# Altium project BeagleBone-AI.PrjPcb (part 4 of 5)

## Sheet 18 ADC_TF_Debug.SchDoc
size 420 x 297 mm
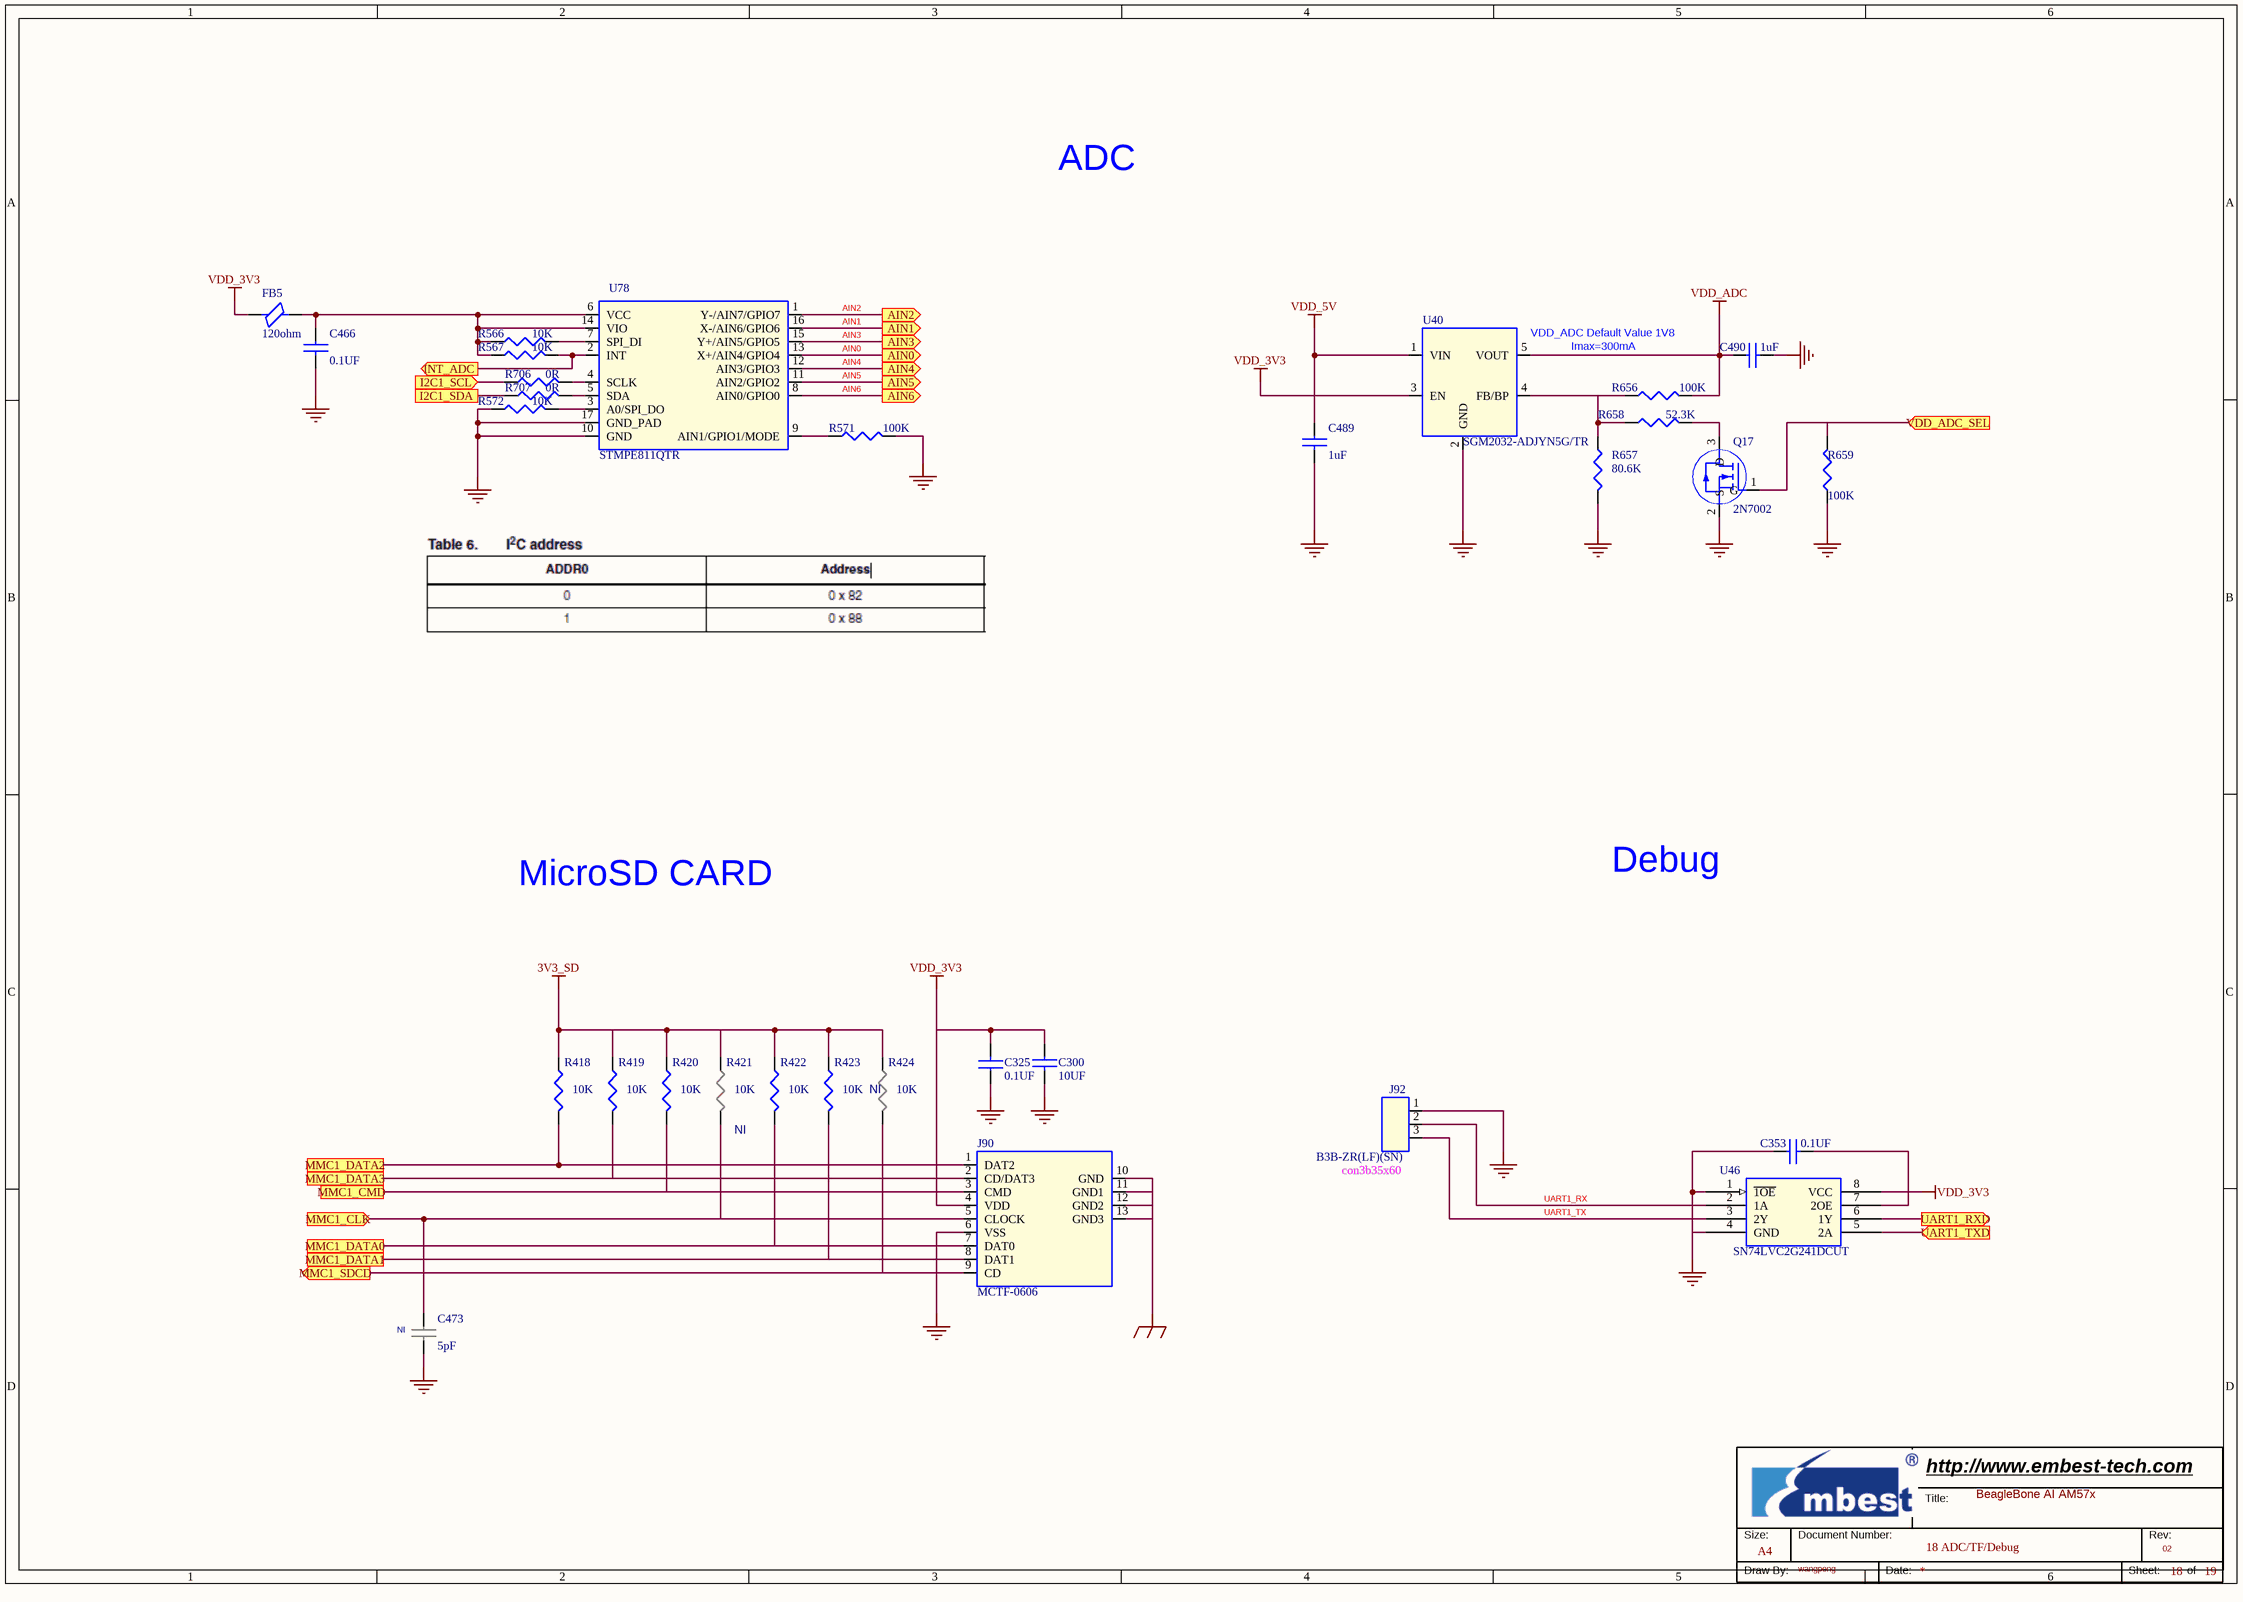
[diagram p19: 18 ADC_TF_Debug.SchDoc]

### Parts
(Parts that share a designator on the sheet are numbered #1, #2 ... from top to bottom, then left to right.)
*#16  Page Count: 19  Page Number: 18  Page Size: A4  Title: BeagleBone AI AM57x  RevCode: 02  Doc: 18 ADC/TF/Debug  Drawing: wangpeng  (hidden comment: Embest Title)  (graphical)
C300  10UF  [C0603]
C325  0.1UF  [C0402]
C353  0.1UF  [C0402]
C466  0.1UF  [C0402]
C473  5pF  ASSY: NI  [C0402]
C489  1uF  [C0402]
C490  1uF  [C0402]
FB5  120ohm  [L0402]
J90  MCTF-0606  [SD_HSF-COMPLIANT_MCTF-0606]
J92  B3B-ZR(LF)(SN)  [con3b35x60]
Q17  2N7002  [SOT23_123]
R418  10K  [R0402]
R419  10K  [R0402]
R420  10K  [R0402]
R421  10K  ASSY: NI  [R0402]
R422  10K  [R0402]
R423  10K  [R0402]
R424  10K  ASSY: NI  [R0402]
R566  10K  [R0402]
R567  10K  [R0402]
R571  100K  [R0402]
R572  10K  [R0402]
R656  100K  [R0402]
R657  80.6K  [R0402]
R658  52.3K  [R0402]
R659  100K  [R0402]
R706  0R  [R0402]
R707  0R  [R0402]
U40  SGM2032-ADJYN5G/TR  [SOT23_5]
U46  SN74LVC2G241DCUT  [vssop8cr]
U78  STMPE811QTR  [QFN50P300X300X100-17N]

### Ports
AIN0 (out), AIN1 (out), AIN2 (out), AIN3 (out), AIN4 (out), AIN5 (out), AIN6 (out), I2C1_SCL (in), I2C1_SDA, INT_ADC (out), MMC1_CLK (in), MMC1_CMD, MMC1_DATA0, MMC1_DATA1, MMC1_DATA2, MMC1_DATA3, MMC1_SDCD (out), UART1_RXD (out), UART1_TXD (in), VDD_ADC_SEL (in)

### Nets
3V3_SD: R418.1 R419.1 R420.1 R421.1 R422.1 R423.1 R424.1
GND: C300.2 C325.1 C353.1 C466.2 C473.2 C489.2 C490.2 J90.6(VSS) J92.1 Q17.2(S) R571.2 R572.1 R657.2 R659.1 U40.2(GND) U46.1(~{1OE}) U46.4(GND) U78.10(GND) U78.17(GND_PAD)  [project net DDR1_RST]
GND_EARTH: J90.10(GND) J90.11(GND1) J90.12(GND2) J90.13(GND3)
VDD_3V3: C300.1 C325.2 FB5.1 J90.4(VDD) U40.3(EN) U46.8(VCC)
VDD_5V: C489.1 U40.1(VIN)
VDD_ADC: C490.1 R656.2 U40.5(VOUT)
AIN0: U78.13(X+/AIN4/GPIO4) ; port AIN0
AIN1: U78.16(X-/AIN6/GPIO6) ; port AIN1
AIN2: U78.1(Y-/AIN7/GPIO7) ; port AIN2
AIN3: U78.15(Y+/AIN5/GPIO5) ; port AIN3
AIN4: U78.12(AIN3/GPIO3) ; port AIN4
AIN5: U78.11(AIN2/GPIO2) ; port AIN5
AIN6: U78.8(AIN0/GPIO0) ; port AIN6
I2C1_SCL: R706.1 ; port I2C1_SCL
I2C1_SDA: R707.1 ; port I2C1_SDA
UART1_RX: J92.2 U46.2(1A)
UART1_TX: J92.3 U46.3(2Y)
NetC353_2: C353.2 U46.7(2OE)
NetC466_1: C466.1 FB5.2 R566.1 R567.1 U78.6(VCC) U78.14(VIO)
NetC473_1: C473.1 J90.5(CLOCK) R421.2 ; port MMC1_CLK
NetJ90_1: J90.1(DAT2) R418.2 ; port MMC1_DATA2
NetJ90_2: J90.2(CD/DAT3) R419.2 ; port MMC1_DATA3
NetJ90_3: J90.3(CMD) R420.2 ; port MMC1_CMD
NetJ90_7: J90.7(DAT0) R422.2 ; port MMC1_DATA0
NetJ90_8: J90.8(DAT1) R423.2 ; port MMC1_DATA1
NetJ90_9: J90.9(CD) R424.2 ; port MMC1_SDCD
NetQ17_1: Q17.1(G) R659.2 ; port VDD_ADC_SEL
NetQ17_3: Q17.3(D) R658.2
NetR173_2: U46.6(1Y) ; port UART1_RXD
NetR566_2: R566.2 U78.7(SPI_DI)
NetR567_2: R567.2 U78.2(INT) ; port INT_ADC
NetR571_1: R571.1 U78.9(AIN1/GPIO1/MODE)
NetR572_2: R572.2 U78.3(A0/SPI_DO)
NetR656_1: R656.1 R657.1 R658.1 U40.4(FB/BP)
NetR706_2: R706.2 U78.4(SCLK)
NetR707_2: R707.2 U78.5(SDA)
NetU4_C26: U46.5(2A) ; port UART1_TXD

### Notes on the sheet
- ADC
- (near U40) VDD_ADC Default Value 1V8
- Imax=300mA
- MicroSD CARD
- Debug
- (in symbol Embest Title) Title:; Size:; Document Number:; Rev:; Draw By:; Date:; Sheet:; of

### Library data of the parts
C300 = C: CAP,10UF,+/-10%,X5R,10V,SMD0603; Manufacturer Part Number: GRM188R61A106KE69D; Manufacturer: Murata; Embest PN: 1004001100129; Datasheet: Y:\ÐÂK3ÏµÍ³ÎïÁÏdatasheet\[1003_1004]capacitor-resistor µçÈÝ¡¢µç×è\1004001100129T2 C1608X5R1A106M.pdf; Part Type: Ceramic Capacitor
C325 C353 = C: CAP,100NF,+/-10%,X7R,16V,SMD0402; Manufacturer: Murata; Manufacturer Part Number: GRM155R71C104KA88D; Embest PN: 1004001100047; Part Type: Ceramic Capacitor; Datasheet: Y:\ÐÂK3ÏµÍ³ÎïÁÏdatasheet\[1003_1004]capacitor-resistor µçÈÝ¡¢µç×è\1004001100047-GRM155R71C104KA88D.pdf
C466 = C: CAP,100NF,+/-10%,X7R,16V,SMD0402; Manufacturer Part Number: GRM155R71C104KA88D; Manufacturer: Murata; Embest PN: 1004001100047; Datasheet: Y:\ÐÂK3ÏµÍ³ÎïÁÏdatasheet\[1003_1004]capacitor-resistor µçÈÝ¡¢µç×è\1004001100047-GRM155R71C104KA88D.pdf; Part Type: Ceramic Capacitor
C473 = C: CAP,5PF,+/-0.25PF,C0G,50V,SMD0402; Manufacturer Part Number: GRM1555C1H5R0CA01D; Manufacturer: Murata; Embest PN: 1004001100004; Part Type: Ceramic Capacitor
C489 = C: CAP,1UF,+/-10%,X5R,10V,SMD0402; Manufacturer: Murata; Manufacturer Part Number: GRM155R61A105KE15D; Embest PN: 1004001100057; Part Type: Ceramic Capacitor
C490 = C: CAP,1UF,+/-10%,X5R,10V,SMD0402; Manufacturer Part Number: GRM155R61A105KE15D; Manufacturer: Murata; Embest PN: 1004001100057; Part Type: Ceramic Capacitor
FB5 = FB: Ferrite Bead,120ohm@100MHz,+/-25%,1300mA,90mohm,SMD0402; Manufacturer: Murata; Manufacturer Part Number: BLM15PD121SN1D; Embest PN: 1005005100058; Part Type: Ferrite Bead
J90 = MCTF-0606: Card Connector MCTF-0606 Connector,MicroSD Card CONN with detect switch,Gold Flash 1u,Black,SMD MTCONN Hamster AM572x; Manufacturer: HSF; Embest PN: 1009017100086; PCB Footprint: SD_HSF-COMPLIANT_MCTF-0606; Part Type: Card Connector; Manufacturer Part Number: MCTF-0606; Status: Hamster AM572x; Datasheet: Y:\ÐÂK3ÏµÍ³ÎïÁÏdatasheet\[1009]connectors Á¬½ÓÆ÷\1009017100086 MCTF-0606.pdf
J92 = SIP3: Connector, Wire-To-Board Top Entry, ZH Series, Through Hole, Header, 3PIN, 1.5 mm, Tin Plated Contacts; Manufacturer: JST; Embest PN: 1009014200068; PCB Footprint: con3b35x60; Part Type: Terminal Block; Manufacturer Part Number: B3B-ZR(LF)(SN); Status: TBD; Datasheet: Y:\ÐÂK3ÏµÍ³ÎïÁÏdatasheet\[1009]connectors Á¬½ÓÆ÷\1009014200068 B3B-ZR(LF)(SN).pdf
Q17 = NMOS: Mosfet,N-Channel,2N7002,60V,115mA,SOT-23,SMD; Manufacturer: FAIRCHILD; Embest PN: 1006015100003; Datasheet: Y:\ÐÂK3ÏµÍ³ÎïÁÏdatasheet\[1006014~16]mosfet ³¡Ð§Ó¦¹Ü\1006015100003 2n7002 Fairchild.pdf; Manufacturer Part Number: 2N7002; Part Type: MOSFET
R418-R424 = R: RES,10K,+/-1%,1/16W,SMD0402; Manufacturer: YAGEO; Manufacturer Part Number: RC0402FR-0710KL; Embest PN: 1003001100071; Part Type: Thick film Resistor
R566 R572 = R: RES,10K,+/-5%,1/16W,SMD0402; Manufacturer Part Number: RC0402JR-0710KL; Manufacturer: YAGEO; Embest PN: 1003001100072; Part Type: Thick film Resistor
R567 = R: RES,10K,+/-5%,1/16W,SMD0402; Manufacturer: YAGEO; Manufacturer Part Number: RC0402JR-0710KL; Embest PN: 1003001100072; Part Type: Thick film Resistor
R571 = R: RES,100K,+/-5%,1/16W,SMD0402; Manufacturer Part Number: RC0402JR-07100KL; Manufacturer: YAGEO; Embest PN: 1003001100119; Part Type: Thick film Resistor
R656 = R: RES,100K,+/-1%,1/16W,SMD0402; Manufacturer: YAGEO; Manufacturer Part Number: RC0402FR-07100KL; Embest PN: 1003001100120; Part Type: Thick film Resistor
R657 = R: RES,80K6,+/-1%,1/16W,SMD0402; Manufacturer Part Number: RC0402FR-0780K6L; Manufacturer: YAGEO; Embest PN: 1003001100565; Part Type: Thick film Resistor
R658 = R: RES,52K3,+/-1%,1/16W,SMD0402; Manufacturer: YAGEO; Manufacturer Part Number: RC0402FR-0752K3L; Embest PN: 1003001100107; Part Type: Thick film Resistor
R659 = R: RES,100K,+/-1%,1/16W,SMD0402; Manufacturer Part Number: RC0402FR-07100KL; Manufacturer: YAGEO; Embest PN: 1003001100120; Part Type: Thick film Resistor
R706 R707 = R: RES,0R,+/-5%,1/16W,SMD0402; Manufacturer Part Number: RC0402JR-070RL; Manufacturer: YAGEO; Embest PN: 1003001100001; Part Type: Thick film Resistor
U40 = SGM2032: IC,300mA Low Power Low Dropout RF Linear Regulators,SGM2032-ADJYN5G/TR,SOT23-5,SMD; Manufacturer: KINGSTON; Embest PN: 1002006100080; Datasheet: Y:\ÐÂK3ÏµÍ³ÎïÁÏdatasheet\[1002]IC ¼¯³ÉµçÂ·\1002006100080_SGM2032_SG-Micro.pdf; Manufacturer Part Number: SGM2032-ADJYN5G/TR; Part Type: LDO
U46 = SN74LVC2G241DCUT: IC,Dual Buffer and Line Driver,SN74LVC2G241DCUT,US8,SMD; Manufacturer: TI; PN: 1002008100076; Status: AVL; Manufacturer Part Number: SN74LVC2G241DCUT; Part Type: Logic; Embest PN: 1002008100076
U78 = STMPE811QTR: 12 bit ADC,S-Touch? advanced resistive touchscreen controller with 8-bit GPIO expander; Manufacturer: STMicroelectronics; Embest PN: 1002020100004; PCB Footprint: QFN50P300X300X100-17N; Part Type: IC; Manufacturer Part Number: STMPE811QTR; Status: Hamster AM572x; Datasheet: Y:\ÐÂK3ÏµÍ³ÎïÁÏdatasheet\[1002]IC ¼¯³ÉµçÂ·\1002020100004_STMPE811_ST.pdf
*#16 = Embest Title: Page Create Date: May 29, 2006; WebSite: http://www.embest-tech.com; Company: Embest; Page Modify Date: *

## Sheet 19 HDMI.SchDoc
size 420 x 297 mm
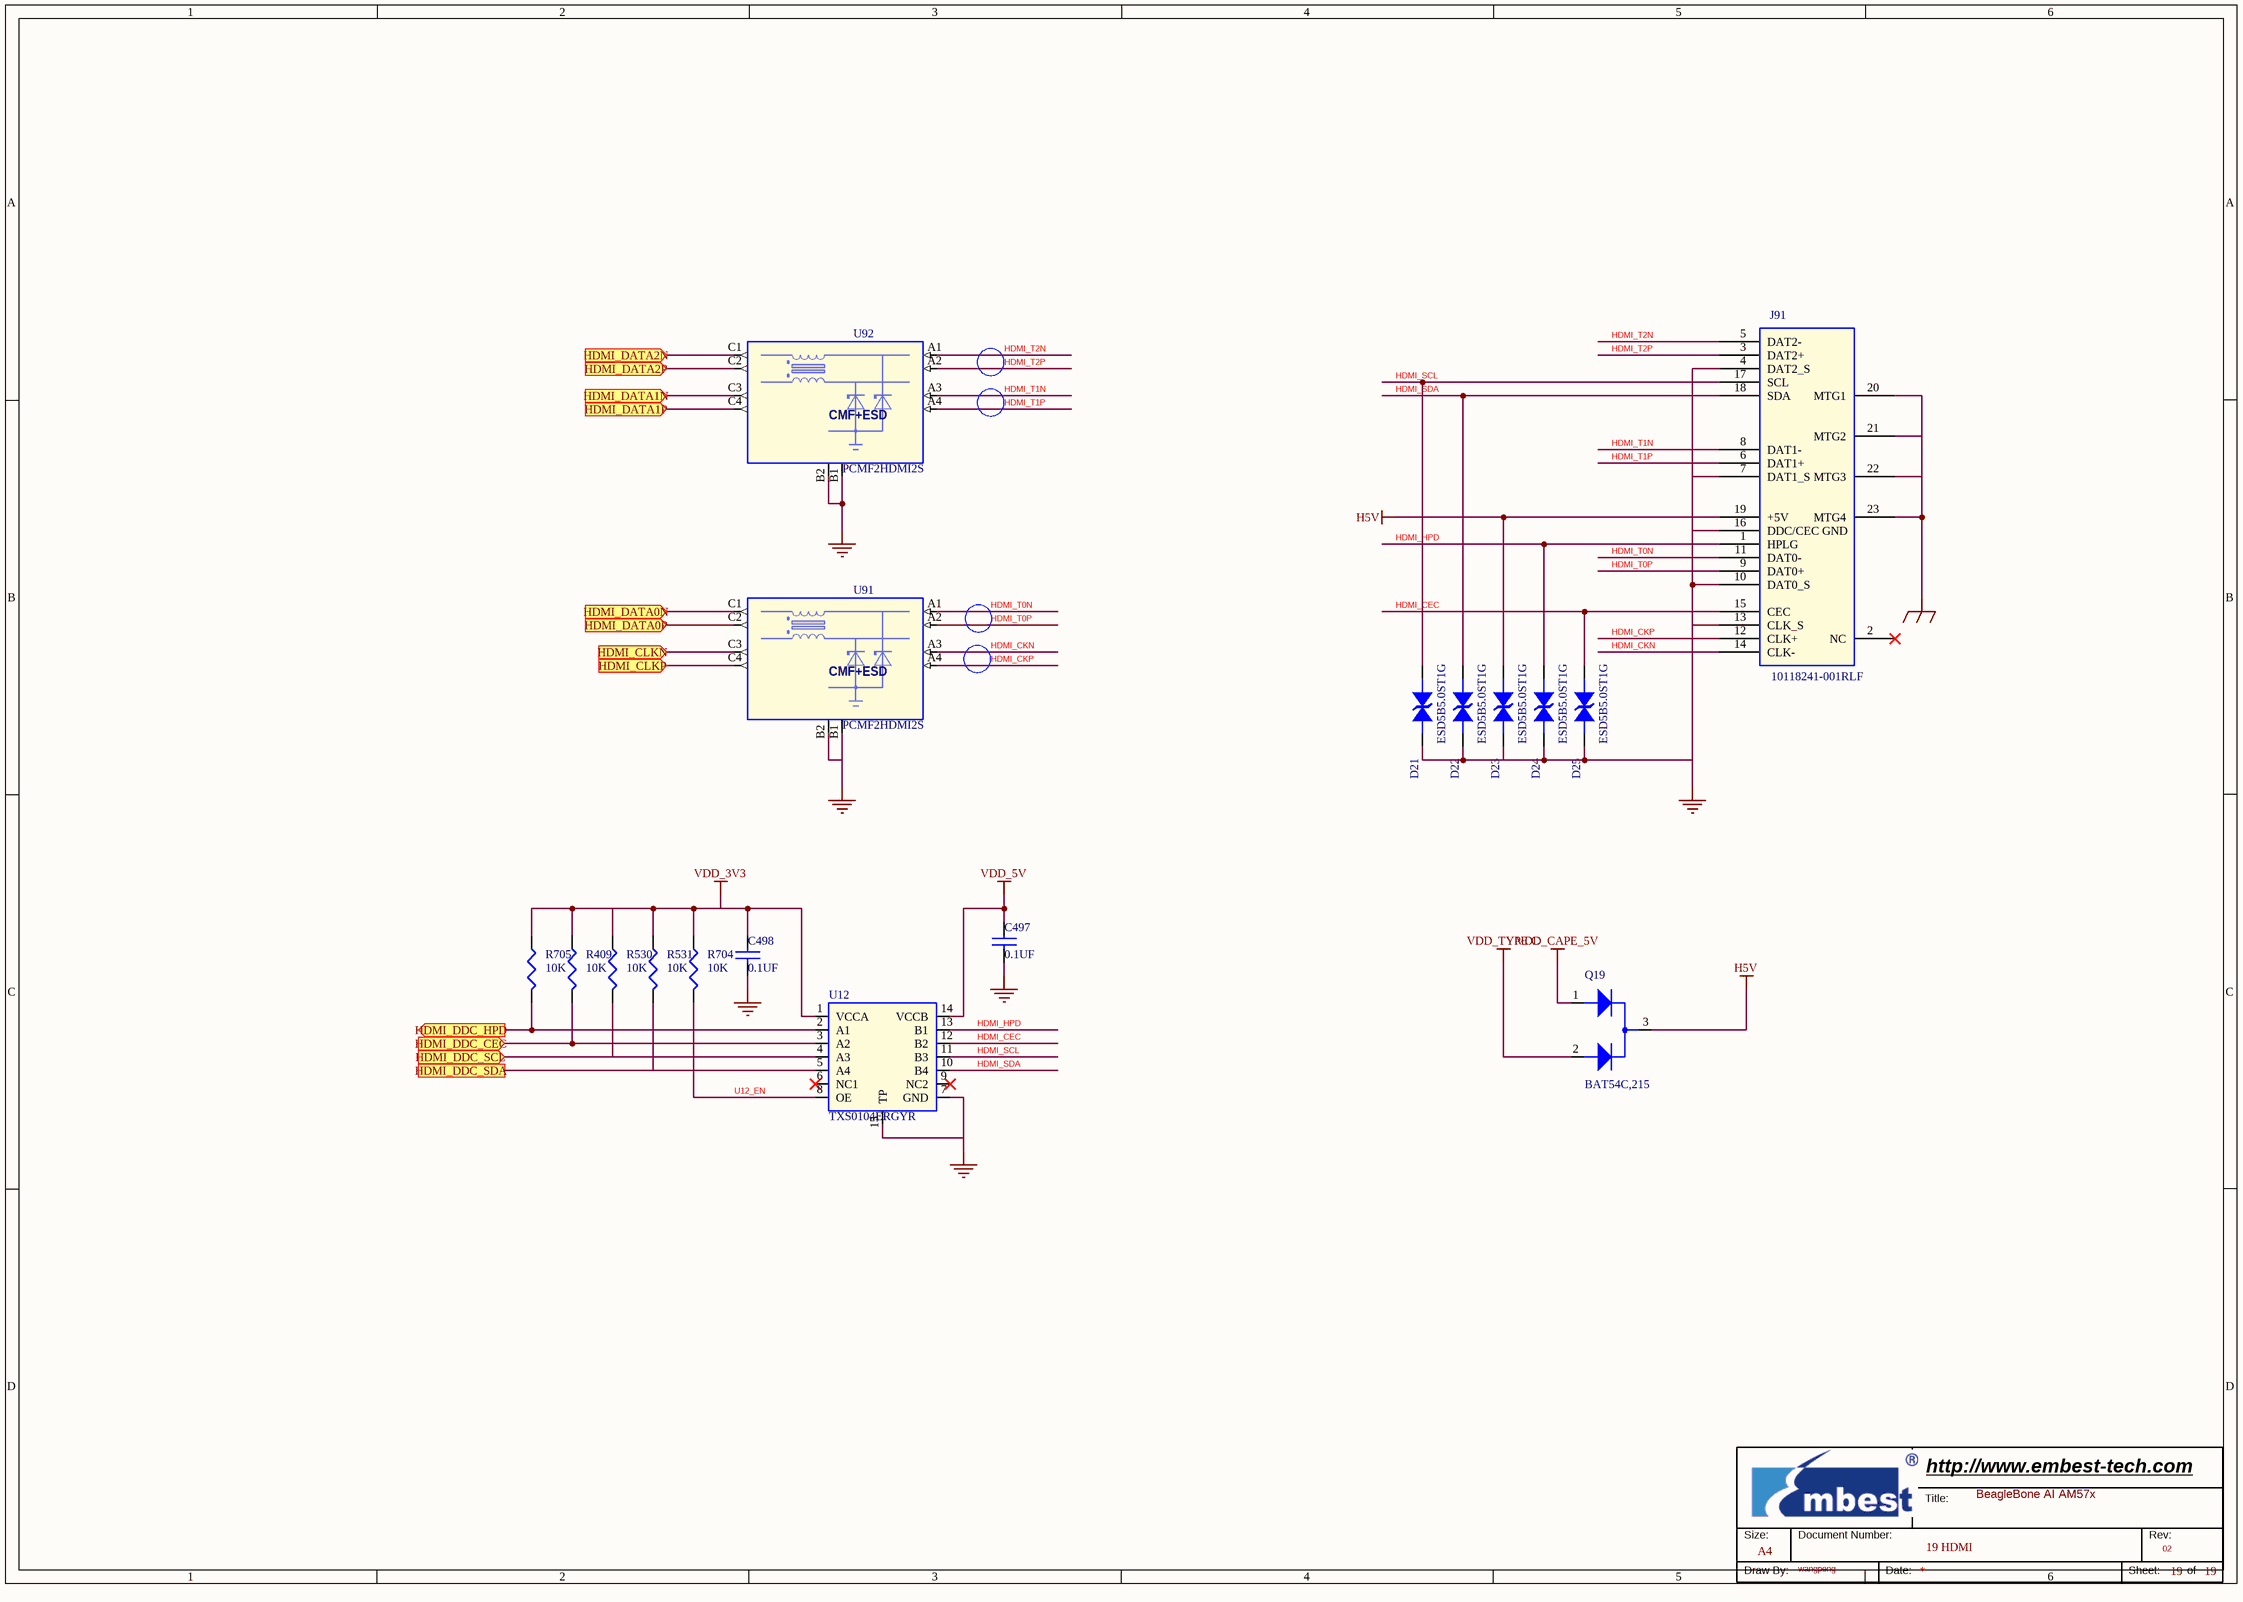
[diagram p20: 19 HDMI.SchDoc]

### Parts
(Parts that share a designator on the sheet are numbered #1, #2 ... from top to bottom, then left to right.)
*#17  Page Count: 19  Page Size: A4  Title: BeagleBone AI AM57x  RevCode: 02  Doc: 19 HDMI  Drawing: wangpeng  (hidden comment: Embest Title)  (graphical)
C497  0.1UF  [C0402]
C498  0.1UF  [C0402]
D21  ESD5B5.0ST1G  [SODFL1608x70N]
D22  ESD5B5.0ST1G  [SODFL1608x70N]
D23  ESD5B5.0ST1G  [SODFL1608x70N]
D24  ESD5B5.0ST1G  [SODFL1608x70N]
D25  ESD5B5.0ST1G  [SODFL1608x70N]
J91  10118241-001RLF  [hdmis19_4p4]
Q19  BAT54C,215  [sot23_123]
R409  10K  [R0402]
R530  10K  [R0402]
R531  10K  [R0402]
R704  10K  [R0402]
R705  10K  [R0402]
U12  TXS0104ERGYR  [qfn50p350x350x100-15n]
U91  PCMF2HDMI2S  [WLCSP10C40p3x4_117x157x60N]
U92  PCMF2HDMI2S  [WLCSP10C40p3x4_117x157x60N]

### Ports
HDMI_CLKN (in), HDMI_CLKP (in), HDMI_DATA0N (in), HDMI_DATA0P (in), HDMI_DATA1N (in), HDMI_DATA1P (in), HDMI_DATA2N (in), HDMI_DATA2P (in), HDMI_DDC_CEC (in), HDMI_DDC_HPD (out), HDMI_DDC_SCL (in), HDMI_DDC_SDA

### Nets
GND: C497.2 C498.2 D21.1 D22.1 D23.1 D24.1 D25.1 J91.4(DAT2_S) J91.7(DAT1_S) J91.10(DAT0_S) J91.13(CLK_S) J91.16(DDC/CEC_GND) U12.7(GND) U12.15(TP) U91.B1(GND_CH1) U91.B2(GND_CH2) U92.B1(GND_CH1) U92.B2(GND_CH2)  [project net DDR1_RST]
GND_EARTH: J91.20(MTG1) J91.21(MTG2) J91.22(MTG3) J91.23(MTG4)
H5V: D23.2 J91.19(+5V) Q19.3
VDD_3V3: C498.1 R409.1 R530.1 R531.1 R704.1 R705.1 U12.1(VCCA)
VDD_5V: C497.1 U12.14(VCCB)
VDD_CAPE_5V: Q19.1
VDD_TYPE C: Q19.2
HDMI_CEC: D25.2 J91.15(CEC) U12.12(B2)
HDMI_CKN: J91.14(CLK-) U91.A3(CH2_IN+)
HDMI_CKP: J91.12(CLK+) U91.A4(CH2_IN-)
HDMI_HPD: D24.2 J91.1(HPLG) U12.13(B1)
HDMI_SCL: D21.2 J91.17(SCL) U12.11(B3)
HDMI_SDA: D22.2 J91.18(SDA) U12.10(B4)
HDMI_T0N: J91.11(DAT0-) U91.A1(CH1_IN+)
HDMI_T0P: J91.9(DAT0+) U91.A2(CH1_IN-)
HDMI_T1N: J91.8(DAT1-) U92.A3(CH2_IN+)
HDMI_T1P: J91.6(DAT1+) U92.A4(CH2_IN-)
HDMI_T2N: J91.5(DAT2-) U92.A1(CH1_IN+)
HDMI_T2P: J91.3(DAT2+) U92.A2(CH1_IN-)
U12_EN: R704.2 U12.8(OE)
NetR409_2: R409.2 U12.3(A2) ; port HDMI_DDC_CEC
NetR530_2: R530.2 U12.4(A3) ; port HDMI_DDC_SCL
NetR531_2: R531.2 U12.5(A4) ; port HDMI_DDC_SDA
NetR705_2: R705.2 U12.2(A1) ; port HDMI_DDC_HPD
NetU4_AG16: U91.C3(CH2_OUT+) ; port HDMI_CLKN
NetU4_AG17: U91.C1(CH1_OUT+) ; port HDMI_DATA0N
NetU4_AG18: U92.C3(CH2_OUT+) ; port HDMI_DATA1N
NetU4_AG19: U92.C1(CH1_OUT+) ; port HDMI_DATA2N
NetU4_AH16: U91.C4(CH2_OUT-) ; port HDMI_CLKP
NetU4_AH17: U91.C2(CH1_OUT-) ; port HDMI_DATA0P
NetU4_AH18: U92.C4(CH2_OUT-) ; port HDMI_DATA1P
NetU4_AH19: U92.C2(CH1_OUT-) ; port HDMI_DATA2P

Not connected (* = marked no-connect by the designer): J91 2(NC)*; U12 6(NC1)* 9(NC2)*

### Notes on the sheet
- (in symbol Embest Title) Title:; Size:; Document Number:; Rev:; Draw By:; Date:; Sheet:; of
- (in symbol PCMF2HDMI2S) CMF+ESD

### Library data of the parts
C497 C498 = C: as C325 on sheet 18 ADC_TF_Debug; Part Type: Ceramic Capacitor; Datasheet: Y:\ÐÂK3ÏµÍ³ÎïÁÏdatasheet\[1003_1004]capacitor-resistor µçÈÝ¡¢µç×è\1004001100047-GRM155R71C104KA88D.pdf
D21-D25 = Diode TVS Dual: Diode,TVS,ESD5B5.0ST1G,5V,50W,SOD-523,SMD; Manufacturer: ON; Embest PN: 1006005100019; Part Type: Diode; Manufacturer Part Number: ESD5B5.0ST1G; Status: BeagleBone AI; Datasheet: Y:\ÐÂK3ÏµÍ³ÎïÁÏdatasheet\[1006002~013]diodes-transistors ¶þÈý¼«¹Ü\1006005100019_ESD5B5.0ST1G_ON
J91 = hdmis19_4p4: Connector,HDMI Receptacle, Type D, Right Angle,DIP+ SMT leg; Manufacturer: FCI; Embest PN: 1009008100005; Part Type: HDMI Connector; Manufacturer Part Number: 10118241-001RLF; Status: BB-Black(AM437x)
Q19 = Diode dual_cc: Diode,Schottky Barrier(Double) Diodes,BAT54C,215,30V,200mA,SOT-23,SMD; Manufacturer: NXP; Embest PN: 1006003100004; Datasheet: Y:\ÐÂK3ÏµÍ³ÎïÁÏdatasheet\[1006002~013]diodes-transistors ¶þÈý¼«¹Ü\1006003100004 BAT54C 215.pdf; Manufacturer Part Number: BAT54C,215; Part Type: Diode
R409 R704 R705 = R: as R418 on sheet 18 ADC_TF_Debug; Part Type: Thick film Resistor
R530 R531 = R: RES,10K,+/-1%,1/16W,SMD0402; Manufacturer Part Number: RC0402FR-0710KL; Manufacturer: YAGEO; Embest PN: 1003001100071; Part Type: Thick film Resistor
U12 = TXS0104ERGYR: IC,TXS0104E 4-Bit Bidirectional Voltage-Level Translator For Open-Drain and Push-PullApplications 14-QFN,SMD; Manufacturer: TI; Embest PN: 1002008100180; Datasheet: Y:\ÐÂK3ÏµÍ³ÎïÁÏdatasheet\[1002]IC ¼¯³ÉµçÂ·\1002008100180 TXS0104ERGYR.pdf; Status: som-sm9300; Manufacturer Part Number: TXS0104ERGYR; Part Type: Logic
U91 U92 = PCMF2HDMI2S: EMI filter with integrated ElectroStatic Discharge protection two differential channels,PCMF2HDMI2S,SMD; Manufacturer: Nexperia; CLASS: IC; Embest PN: 1013002100030; Status: IMX 8; Manufacturer Part Number: PCMF2HDMI2S; Part Type: Filter
*#17 = Embest Title: Page Number: 19; Page Create Date: May 29, 2006; WebSite: http://www.embest-tech.com; Company: Embest; Page Modify Date: *

## Sheet PMIC REGULATORS.SchDoc
size B
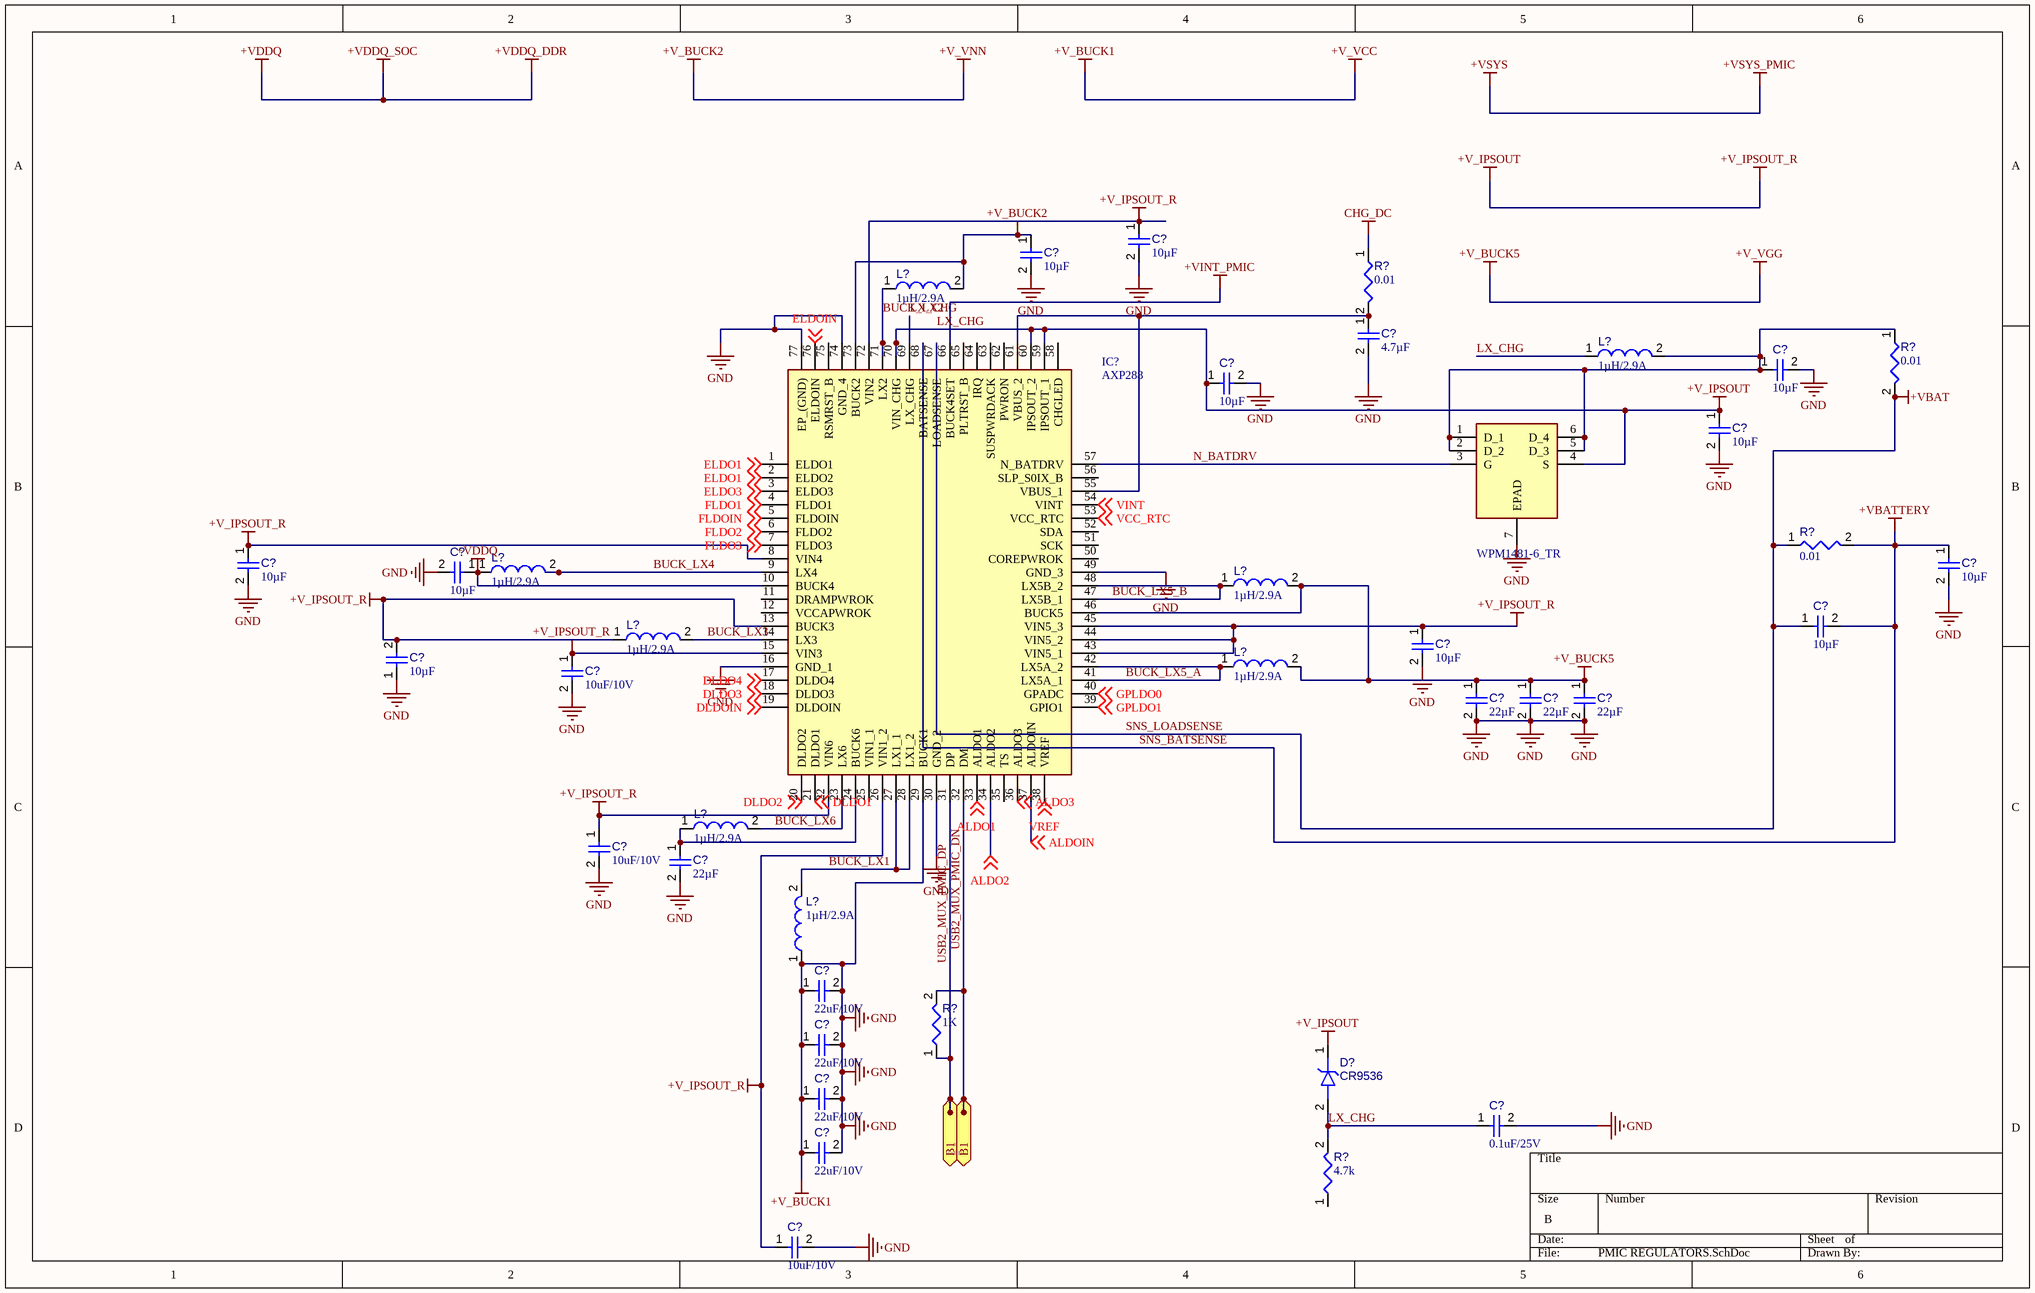
[diagram p21: PMIC REGULATORS.SchDoc]

### Parts
(Parts that share a designator on the sheet are numbered #1, #2 ... from top to bottom, then left to right.)
?  WPM1481-6_TR  [SON65P200X200X80-7N-D]
C?#1  value 10µF  [CAPC0402(1005)60_L]  (hidden comment: Capacitor 10µF +/-40% 6.3V 0402)
C?#2  value 10µF  [CAPC0402(1005)60_L]  (hidden comment: Capacitor 10µF +/-40% 6.3V 0402)
C?#3  value 4.7µF  [CAPC0805(2012)145_L]  (hidden comment: Capacitor 47µF +/-40% 6.3V 0805)
C?#4  value 10µF  [CAPC0402(1005)60_L]  (hidden comment: Capacitor 10µF +/-40% 6.3V 0402)
C?#5  value 10µF  [CAPC0805(2012)145_L]  (hidden comment: Capacitor 10µF +/-20% 25V 0805)
C?#6  value 10µF  [CAPC0402(1005)60_L]  (hidden comment: Capacitor 10µF +/-40% 6.3V 0402)
C?#7  value 10µF  [CAPC0402(1005)60_L]  (hidden comment: Capacitor 10µF +/-40% 6.3V 0402)
C?#8  value 10µF  [CAPC3216X180X50ML20T25]  (hidden comment: Capacitor 10 uF +/- 10% 16 V 1206)
C?#9  value 10µF  [CAPC0402(1005)60_L]  (hidden comment: Capacitor 10µF +/-40% 6.3V 0402)
C?#10  value 10µF  [CAPC0402(1005)60_L]  (hidden comment: Capacitor 10µF +/-40% 6.3V 0402)
C?#11  value 10µF  [CAPC3216X180X50ML20T25]  (hidden comment: Capacitor 10 uF +/- 10% 16 V 1206)
C?#12  value 10uF/10V  [CAPC0402(1005)60_L]  (hidden comment: Capacitor 100nF +/-20% 25V 0402)
C?#13  value 10µF  [CAPC0402(1005)60_L]  (hidden comment: Capacitor 10µF +/-40% 6.3V 0402)
C?#14  value 22µF  [CAPC0402(1005)60_L]  (hidden comment: Capacitor 10µF +/-40% 6.3V 0402)
C?#15  value 22µF  [CAPC0402(1005)60_L]  (hidden comment: Capacitor 10µF +/-40% 6.3V 0402)
C?#16  value 22µF  [CAPC0402(1005)60_L]  (hidden comment: Capacitor 10µF +/-40% 6.3V 0402)
C?#17  value 10uF/10V  [CAPC0402(1005)60_L]  (hidden comment: Capacitor 100nF +/-20% 25V 0402)
C?#18  value 22µF  [CAPC0402(1005)60_L]  (hidden comment: Capacitor 10µF +/-40% 6.3V 0402)
C?#19  value 22uF/10V  [CAPC0402(1005)60_L]  (hidden comment: Capacitor 10µF +/-40% 6.3V 0402)
C?#20  value 22uF/10V  [CAPC0402(1005)60_L]  (hidden comment: Capacitor 10µF +/-40% 6.3V 0402)
C?#21  value 22uF/10V  [CAPC0402(1005)60_L]  (hidden comment: Capacitor 10µF +/-40% 6.3V 0402)
C?#22  value 0.1uF/25V  [CAPC0402(1005)33_L]  (hidden comment: Capacitor 680pF +/-20% 50V 0402)
C?#23  value 22uF/10V  [CAPC0402(1005)60_L]  (hidden comment: Capacitor 10µF +/-40% 6.3V 0402)
C?#24  value 10uF/10V  [CAPC0402(1005)60_L]  (hidden comment: Capacitor 100nF +/-20% 25V 0402)
D?#1  CR9536  [STM-QFN1610]
IC?  AXP288  [QFN40P900X900X90-77N-D]
L?#1  WPN252012H1R0MT: 1µH/2.9A  [WE-LQS 4018]  (hidden comment: 74404042330)
L?#2  WPN252012H1R0MT: 1µH/2.9A  [WE-LQS 4018]  (hidden comment: 74404042330)
L?#3  WPN252012H1R0MT: 1µH/2.9A  [WE-LQS 4018]  (hidden comment: 74404042330)
L?#4  WPN252012H1R0MT: 1µH/2.9A  [WE-LQS 4018]  (hidden comment: 74404042330)
L?#5  WPN252012H1R0MT: 1µH/2.9A  [WE-LQS 4018]  (hidden comment: 74404042330)
L?#6  WPN252012H1R0MT: 1µH/2.9A  [WE-LQS 4018]  (hidden comment: 74404042330)
L?#7  WPN252012H1R0MT: 1µH/2.9A  [WE-LQS 4018]  (hidden comment: 74404042330)
L?#8  WPN252012H1R0MT: 1µH/2.9A  [WE-LQS 4018]  (hidden comment: 74404042330)
R?#1  value 0.01  [RESC0402(1005)_L]  (hidden comment: Resistor 47K5 +/-1 % 0402 63 mW)
R?#2  value 0.01  [RESC0402(1005)_L]  (hidden comment: Resistor 47K5 +/-1 % 0402 63 mW)
R?#3  value 0.01  [RESC0402(1005)_L]  (hidden comment: Resistor 47K5 +/-1 % 0402 63 mW)
R?#4  value 1K  [RESC0402(1005)_L]  (hidden comment: Resistor 47K5 +/-1 % 0402 63 mW)
R?#5  value 4.7k  [RESC1005X40X25ML05T05]  (hidden comment: Resistor 4k7 +/-1% 0402 63 mW)

### Ports
B1 (bidir)

### Nets
+V_BUCK1: ?.7(EPAD) C?#1.2 C?#2.2 C?#3.2 C?#4.2 C?#5.2 C?#6.2 C?#7.2 C?#8.2 C?#9.2 C?#10.2 C?#12.2 C?#13.1 C?#14.2 C?#15.2 C?#16.2 C?#17.2 C?#18.2 C?#19.1 C?#19.2 C?#20.1 C?#20.2 C?#21.1 C?#21.2 C?#22.2 C?#23.1 C?#23.2 C?#24.2 IC?.16(GND_1) IC?.29(BUCK1) IC?.30(GND_2) IC?.49(GND_3) IC?.74(GND_4) IC?.77(EP_(GND)) L?#8.1  [also labelled +V_VCC, GND]  [project net DDR1_RST]
+V_BUCK2: C?#2.1 IC?.73(BUCK2) L?#1.2  [also labelled +V_VNN]
+V_BUCK5: C?#14.1 C?#15.1 C?#16.1 IC?.46(BUCK5) L?#4.2 L?#6.2  [also labelled +V_VGG]
+VDDQ: C?#9.1 IC?.10(BUCK4) L?#3.1  [also labelled +VDDQ_DDR, +VDDQ_SOC]
+VINT_PMIC: IC?.66(BUCK4SET)
CHG_DC: R?#1.1
LX_CHG: ?.4(S) C?#1.1 C?#5.1 C?#6.1 C?#7.1 C?#10.1 C?#12.1 C?#13.2 C?#17.1 C?#22.1 C?#24.1 D?#1.1(A) D?#1.2(A) IC?.8(VIN4) IC?.13(BUCK3) IC?.15(VIN3) IC?.22(VIN6) IC?.26(VIN1_2) IC?.43(VIN5_1) IC?.44(VIN5_2) IC?.45(VIN5_3) IC?.59(IPSOUT_1) IC?.60(IPSOUT_2) IC?.69(LX_CHG) IC?.70(VIN_CHG) IC?.72(VIN2) L?#2.1 L?#5.1 R?#5.2  [also labelled +V_IPSOUT, +V_IPSOUT_R]
SNS_BATSENSE: C?#8.1 C?#11.2 IC?.68(BATSENSE) R?#3.2  [also labelled +VBATTERY]
SNS_LOADSENSE: C?#11.1 IC?.67(LOADSENSE) R?#2.2 R?#3.1  [also labelled +VBAT]
ALDO1: IC?.33(ALDO1) ; off-sheet ALDO1
ALDO2: IC?.34(ALDO2) ; off-sheet ALDO2
ALDO3: IC?.36(ALDO3) ; off-sheet ALDO3
ALDOIN: IC?.37(ALDOIN) ; off-sheet ALDOIN
BUCK_LX1: IC?.27(LX1_1) IC?.28(LX1_2) L?#8.2
BUCK_LX2: IC?.71(LX2) L?#1.1
BUCK_LX3: IC?.14(LX3) L?#5.2
BUCK_LX4: IC?.9(LX4) L?#3.2
BUCK_LX5_A: IC?.41(LX5A_1) IC?.42(LX5A_2) L?#6.1
BUCK_LX5_B: IC?.47(LX5B_1) IC?.48(LX5B_2) L?#4.1
BUCK_LX6: IC?.23(LX6) L?#7.2
DLDO1: IC?.21(DLDO1) ; off-sheet DLDO1
DLDO2: IC?.20(DLDO2) ; off-sheet DLDO2
DLDO3: IC?.18(DLDO3) ; off-sheet DLDO3
DLDO4: IC?.17(DLDO4) ; off-sheet DLDO4
DLDOIN: IC?.19(DLDOIN) ; off-sheet DLDOIN
ELDO1: IC?.1(ELDO1) IC?.2(ELDO2) ; off-sheet ELDO1
ELDO3: IC?.3(ELDO3) ; off-sheet ELDO3
ELDOIN: IC?.76(ELDOIN) ; off-sheet ELDOIN
FLDO1: IC?.4(FLDO1) ; off-sheet FLDO1
FLDO2: IC?.6(FLDO2) ; off-sheet FLDO2
FLDO3: IC?.7(FLDO3) ; off-sheet FLDO3
FLDOIN: IC?.5(FLDOIN) ; off-sheet FLDOIN
GPLDO0: IC?.40(GPADC) ; off-sheet GPLDO0
GPLDO1: IC?.39(GPIO1) ; off-sheet GPLDO1
N_BATDRV: ?.3(G) IC?.57(N_BATDRV)
USB2_MUX_PMIC_DN: IC?.31(DP) IC?.32(DM) R?#4.1 R?#4.2 ; port B1  [also labelled USB2_MUX_PMIC_DP]
VCC_RTC: IC?.53(VCC_RTC) ; off-sheet VCC_RTC
VINT: IC?.54(VINT) ; off-sheet VINT
VREF: IC?.38(VREF) ; off-sheet VREF
Net?_1: ?.1(D_1) ?.2(D_2) ?.5(D_3) ?.6(D_4) C?#4.1 L?#2.2 R?#2.1
NetC?#3_1: C?#3.1 IC?.55(VBUS_1) IC?.61(VBUS_2) R?#1.2
NetC?#18_1: C?#18.1 IC?.24(BUCK6) L?#7.1

Not connected (* = marked no-connect by the designer): IC? 11(DRAMPWROK) 12(VCCAPWROK) 25(VIN1_1) 35(TS) 50(COREPWROK) 51(SCK) 52(SDA) 56(SLP_S0IX_B) 58(CHGLED) 62(PWRON) 63(SUSPWRDACK) 64(IRQ) 65(PLTRST_B) 75(RSMRST_B); R?#5 1

### Library data of the parts
? = WPM1481-6_TR: Integrated Circuit; Manufacturer_Name: Will Semiconductor; Manufacturer_Part_Number: WPM1481-6/TR; Datasheet Link: http://hands.com/~lkcl/eoma/allwinner/a31/WPM1481.pdf; Height: 0.8mm
C?#1 C?#2 C?#4 C?#6 C?#7 C?#9 C?#10 C?#13-C?#16 C?#18-C?#21 C?#23 = CMP-001-00074-2: Chip Capacitor, 10µF +/-40%, 6.3V, 0402, Thickness 0.6 mm; Tolerance: 10%; Max Operating Temperature: 85°C; Pins: 2; Case/Package: 0402; Min Operating Temperature: -55°C; Voltage Rating: 6.3V; Mounting Technology: SMT
C?#3 = CMP-001-00082-2: Chip Capacitor, 47µF +/-40%, 6.3V, 0805, Thickness 1.45 mm; Tolerance: 10%; Max Operating Temperature: 85°C; Case/Package: 0402; Min Operating Temperature: -55°C; Voltage Rating: 6.3V; Pins: 2; Mounting Technology: SMT
C?#5 = CMP-001-00079-2: Chip Capacitor, 10µF +/-20%, 25V, 0805, Thickness 1.45 mm; Tolerance: 10%; Pins: 2; Max Operating Temperature: 85°C; Mounting Technology: SMT; Case/Package: 0603; Voltage Rating: 25V; Min Operating Temperature: -55°C
C?#8 C?#11 = CMP-001-00016-4: Chip Capacitor, 10 uF, +/- 10%, 16 V, 1206 (3216 Metric); Voltage Rating: 16V; Capacitor Type: Ceramic; Tolerance: 10%; Pins: 2; Case/Package: 1206; Mounting Technology: SM; RoHS Compliant: True; Max Operating Temperature: 125°C; Min Operating Temperature: -55°C
C?#12 C?#17 C?#24 = CMP-001-00065-2: Chip Capacitor, 100nF +/-20%, 25V, 0402, Thickness 0.6 mm; Tolerance: 10%; Pins: 2; Min Operating Temperature: -55°C; Max Operating Temperature: 85°C; Mounting Technology: SMT; Case/Package: 0603; Voltage Rating: 25V
C?#22 = CMP-001-00070-2: Chip Capacitor, 680pF +/-20%, 50V, 0402, Thickness 0.33 mm; Tolerance: 10%; Pins: 2; Min Operating Temperature: -55°C; Max Operating Temperature: 85°C; Mounting Technology: SMT; Case/Package: 0402; Voltage Rating: 50V
D?#1 = CMP-004-00023-2: CR9536 / 5V6; Max Surge Current: 35A; Peak Inverse Voltage: 23.3V; RoHS Compliant: Yes; Mounting Technology: SMT; Pins: 2; Case/Package: QFN1610 (0603)
IC? = AXP288: Integrated Circuit; Manufacturer_Name: X-Powers; Datasheet Link: http://www.x-powers.com/en.php/Info/support/article_id/60; Height: 0.9mm; Manufacturer_Part_Number: AXP288
L?#1-L?#8 = CMP-006-00018-2: WE-LQS SMD Power Inductor, L=33 µH; Tolerance: 20%; ComponentLink2URL: http://katalog.we-online.de/pbs/datasheet/74404042330.pdf; ComponentLink2Description: Datasheet; ComponentLink1Description: Manufacturer URL; Pins: 2; ComponentLink1URL: http://www.we-online.com
R?#1-R?#3 = CMP-009-00137-2: Chip Resistor, 47,5 kOhms, +/-1 %, 63 mW, -55 to 155 degC, 0402; Tolerance: 1%; Power: 63mW; Pins: 2; Case/Package: 0402; Max Operating Temperature: 155°C; Min Operating Temperature: -55°C
R?#4 = CMP-009-00137-2: Chip Resistor,0ROhms, +/-1 %, 63 mW, -55 to 155 degC, 0402; Tolerance: 1%; Power: 63mW; Pins: 2; Case/Package: 0402; Max Operating Temperature: 155°C; Min Operating Temperature: -55°C
R?#5 = CMP-009-00034-4: Chip Resistor, 4.7 KOhm, +/- 1%, 63 mW, -55 to 155 degC, 0402 (1005 Metric); Voltage Rating: 50V; Power: 63mW; Tolerance: 1%; Pins: 2; Case/Package: 0402; Mounting Technology: SM; Min Operating Temperature: -55°C; Max Operating Temperature: 155°C; RoHS Compliant: True

## Sheet GPS_NEO.SchDoc
size B
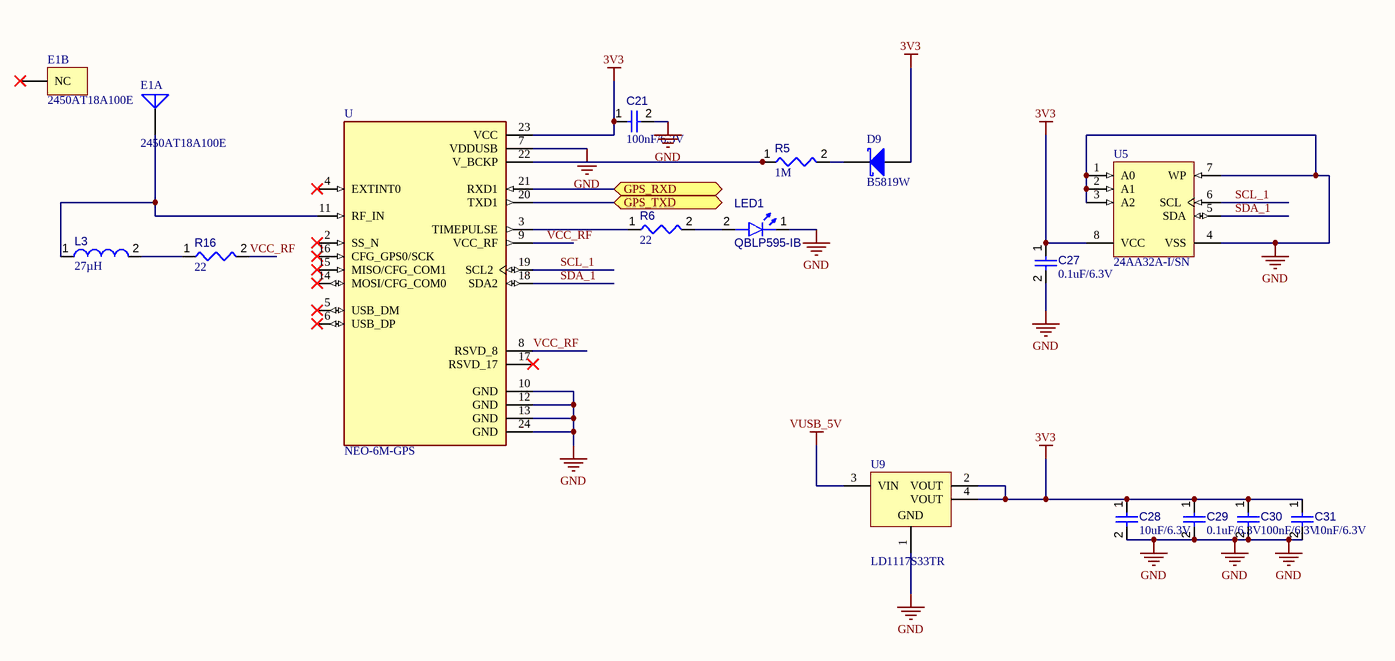
[diagram p22: GPS_NEO.SchDoc]

### Parts
C21  value 100nF/6.3V  [CAPC0402(1005)60_L]  (hidden comment: Capacitor 220nF +/-20% 10V 0402)
C27  value 0.1uF/6.3V  [CAPC0402(1005)60_L]  (hidden comment: Capacitor 220nF +/-20% 10V 0402)
C28  value 10uF/6.3V  [CAPC0402(1005)60_L]  (hidden comment: Capacitor 220nF +/-20% 10V 0402)
C29  value 0.1uF/6.3V  [CAPC0402(1005)60_L]  (hidden comment: Capacitor 220nF +/-20% 10V 0402)
C30  value 100nF/6.3V  [CAPC0402(1005)60_L]  (hidden comment: Capacitor 220nF +/-20% 10V 0402)
C31  value 10nF/6.3V  [CAPC0402(1005)60_L]  (hidden comment: Capacitor 220nF +/-20% 10V 0402)
D9  B5819W  [MCC-SOD123_V]
E1  2450AT18A100E  [JT-2450AT18A100-2_V]  (parts A,B of 2)
L3  value 27µH  [IND1005X55X20VL5T10]  (hidden comment: ELJ-RF2N2DFB)
LED1  QBLP595-IB  [QTB-QBLP595_V]
R5  value 1M  [RESC0402(1005)_L]  (hidden comment: Resistor 1M +/-5 % 0402 63 mW)
R6  value 22  [RESC0402(1005)_L]  (hidden comment: Resistor 22R  +/-5 % 0402 63 mW)
R16  value 22  [RESC0402(1005)_L]  (hidden comment: Resistor 22R  +/-5 % 0402 63 mW)
U  NEO-6M-GPS  [XCVR_NEO-6M-GPS]
U5  24AA32A-I/SN  [SOIC-SN8_N]
U9  LD1117S33TR  [STM-SOT-223_M]

### Ports
GPS_RXD (bidir), GPS_TXD (bidir)

### Nets
3V3: C21.1 C27.1 C28.1 C29.1 C30.1 C31.1 D9.1(A) U.23(VCC) U5.8(VCC) U9.2(VOUT) U9.4(VOUT)
GND: C21.2 C27.2 C28.2 C29.2 C30.2 C31.2 LED1.1(K) U.7(VDDUSB) U.10(GND) U.12(GND) U.13(GND) U.24(GND) U5.1(A0) U5.2(A1) U5.3(A2) U5.4(VSS) U5.7(WP) U9.1(GND)  [project net DDR1_RST]
VUSB_5V: U9.3(VIN)
SCL_1: U.19(SCL2) U5.6(SCL)
SDA_1: U.18(SDA2) U5.5(SDA)
VCC_RF: R16.2 U.8(RSVD_8) U.9(VCC_RF)
NetD9_2: D9.2(K) R5.2
NetE1_1: E1.1(FP) L3.1 U.11(RF_IN)
NetL3_2: L3.2 R16.1
NetLED1_2: LED1.2(A) R6.2
NetR5_1: R5.1 U.22(V_BCKP)
NetR6_1: R6.1 U.3(TIMEPULSE)
NetU_20: U.20(TXD1) ; port GPS_TXD
NetU_21: U.21(RXD1) ; port GPS_RXD

Not connected (* = marked no-connect by the designer): E1 2(NC)*; U 2(SS_N)* 4(EXTINT0)* 5(USB_DM)* 6(USB_DP)* 14(MOSI/CFG_COM0)* 15(MISO/CFG_COM1)* 16(CFG_GPS0/SCK)* 17(RSVD_17)*

### Library data of the parts
C21 C27-C31 = CMP-001-00057-2: Chip Capacitor, 220nF +/-20%, 10V, 0402, Thickness 0.6 mm; Tolerance: 10%; Case/Package: 0402; Mounting Technology: SMT; Pins: 2; Max Operating Temperature: 85°C; Min Operating Temperature: -55°C; Voltage Rating: 10V
D9 = CMP-004-00005-1: Schottky Barrier Rectifier, 40 V, 1 A, -65 to 125 degC, 2-Pin SOD123, RoHS, Tape and Reel; Manufacturer: Micro Commercial Components; Manufacturer URL: http://www.mccsemi.com/; Package Reference: SOD123; Package URL: http://www.mccsemi.com/up_pdf/1N4448W(SOD-123).pdf; Mounting Technology: SM; Datasheet URL: http://www.mccsemi.com/up_pdf/B5817W-B5819W(SOD-123).pdf; Package Description: 2-Pin Small Outline Diode, Body 2.7 x 1.6 mm, Height 1.35 mm; Case/Package: SOD123; Datasheet Version: Rev. B, 01/2013; RoHS Compliant: Unknown
E1 = CMP-2000-05167-1: Ceramic Antenna, 2.45 GHZ, 2 W, -40 to 125 degC, 2-Pin SMD, RoHS, Tape and Reel; Manufacturer: Johanson Technology; Maximum Frequency: 2500MHz; Typical Antenna Gain: 0.5dB; Minimum Frequency: 2400MHz; Manufacturer URL: https://www.johansontechnology.com/; Type: Ceramic; Datasheet Version: Rev. 1.3, 07/2014; Category: Antenna; Package: 2Case18-4; Datasheet URL: http://www.johansontechnology.com/datasheets/antennas/2450AT18A100.pdf
L3 = CMP-006-00006-4: Chip Inductor, 2.2 nH, +/- 0.3 nH, 400 mA, -40 to 85 degC, 0402 (1005 Metric), RoHS, Tape and Reel; Manufacturer: Panasonic; Current Rating: 400mA; Tolerance: 5%; Shielding: Unshielded; Core Material: Ceramic; Q Factor: 8; Package Reference: 0402; Package Description: 2-Pin Surface Mount Device, Body 1 x 0.5 mm; Packaging: TapeandReel; Max Operating Temperature: 85°C; Case/Package: 0402; Min Operating Temperature: -20°C; Mounting Technology: SM; Package Quantity: 10000; Datasheet Version: Sep-12; RoHS Compliant: True; Datasheet URL: http://www.bourns.com/docs/Product-Datasheets/cm322522.pdf
LED1 = CMP-007-00042-2: Chip LED 0402, Blue, 0.02 A, 3.1 to 3.7 V, -40 to 80 degC, 2-Pin SMD, RoHS, Tape and Reel; Mounting Technology: SMT; Colour: Blue; RoHS Compliant: Yes; Pins: 2; Case/Package: 0402
R5 = CMP-009-00151-2: Chip Resistor, 1 MOhms, +/-5 %, 63 mW, -55 to 155 degC, 0402; Power: 63mW; Tolerance: 5%; Min Operating Temperature: -55°C; Max Operating Temperature: 155°C; Pins: 2; Case/Package: 0402
R6 R16 = CMP-009-00164-2: Chip Resistor, 22 Ohms, +/-5 %, 63 mW, -55 to 155 degC, 0402; Tolerance: 5%; Power: 63mW; Max Operating Temperature: 155°C; Case/Package: 0402; Pins: 2; Min Operating Temperature: -55°C
U = NEO-6M-GPS: SMD GPS Module;; MF: u-blox; Availability: Unavailable; MP: NEO-6M-GPS; Package: None; SnapEDA_Link: https://www.snapeda.com/parts/NEO-6M-GPS/u-blox/view-part/105879/?ref=snap; Value: *; Price: None
U5 = CMP-0159-00205-1: 32Kbit, 400kHz, 1.7V, I2C Serial EEPROM, 8-Pin SOIC 150mil, Industrial Temperature; Code_JEDEC: MS-012; PackageVersion: revBB, Aug-2009; PackageReference: SOIC-SN8; PackageDescription: 8-Lead Plastic Small Outline (SN) - Narrow, 3.90mm Body [SOIC]; Code_IPC: SOIC127P600-8; DatasheetVersion: revJ, Feb-2009
U9 = CMP-019-00019-2: Low Drop Positive Voltage Regulator, 800 mA, Fixed 3.3 V Output, 0 to 125 degC, 3-Pin TO-220, RoHS, Tape and Reel; Manufacturer: STMicroelectronics; Outputs: 1; Min Input Voltage: 4.75V; Max Supply Voltage: 15V; Power: 12W; Dropout Voltage: 1.1V; Max Ouput Current: 1.3A; Output Voltage: 3.3V; Output Current: 950mA; Mounting Technology: SM; Datasheet Version: Rev. 33, 11/2013; Datasheet URL: http://www.farnell.com/datasheets/1776449.pdf; Max Operating Temperature: 125°C; Min Operating Temperature: 0°C; RoHS Compliant: True; Case/Package: TO-261-4; Max Input Voltage: 15V; Manufacturer URL: http://www.st.com/; Min Supply Voltage: 4.75V; Package Quantity: 2500; Nominal Output Voltage: 3.3V; Package Description: 4-Pin Small Outline Transistor, Body 6.5 x 3.5 mm, Pitch 2.3 mm; Pins: 3; Packaging: TapeandReel; Package Reference: SOT-223

## Sheet BMS_Circuit.SchDoc
size B
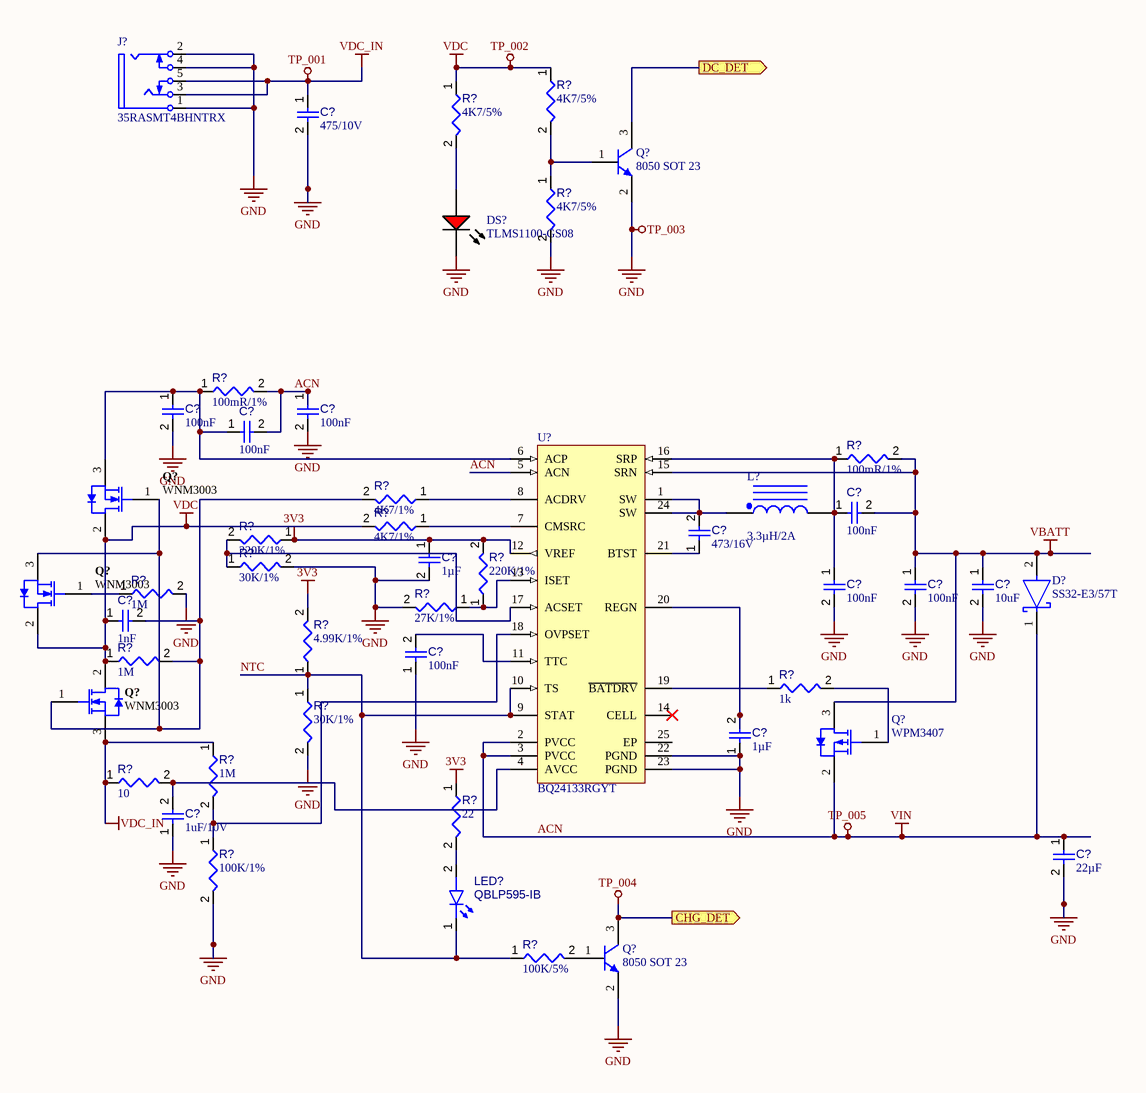
[diagram p23: BMS_Circuit.SchDoc]

### Parts
(Parts that share a designator on the sheet are numbered #1, #2 ... from top to bottom, then left to right.)
C?#25  value 475/10V  [CAPC0402(1005)60_L]  (hidden comment: Capacitor 100nF +/-20% 10V 0402)
C?#26  value 100nF  [CAPC0402(1005)60_L]  (hidden comment: Capacitor 100nF +/-20% 50V 0402)
C?#27  value 100nF  [CAPC0402(1005)60_L]  (hidden comment: Capacitor 100nF +/-20% 50V 0402)
C?#28  value 100nF  [CAPC0402(1005)60_L]  (hidden comment: Capacitor 100nF +/-20% 50V 0402)
C?#29  value 100nF  [CAPC0402(1005)60_L]  (hidden comment: Capacitor 100nF +/-20% 25V 0402)
C?#30  value 1µF  [CAPC1005X55X25ML05T10]  (hidden comment: Capacitor 1 uF +/- 10% 6.3 V 0402)
C?#31  value 473/16V  [CAPC0402(1005)60_L]  (hidden comment: Capacitor 1µF +/-20% 10V 0402)
C?#32  value 100nF  [CAPC0402(1005)60_L]  (hidden comment: Capacitor 100nF +/-20% 10V 0402)
C?#33  value 100nF  [CAPC0402(1005)60_L]  (hidden comment: Capacitor 100nF +/-20% 10V 0402)
C?#34  value 10uF  [CAPC0402(1005)60_L]  (hidden comment: Capacitor 100nF +/-20% 10V 0402)
C?#35  value 1nF  [CAPC0805(2012)145_L]  (hidden comment: Capacitor 100µF +/-20% 6.3V 0805)
C?#36  value 100nF  [CAPC0402(1005)60_L]  (hidden comment: Capacitor 100nF +/-20% 10V 0402)
C?#37  value 1µF  [CAPC0402(1005)60_L]  (hidden comment: Capacitor 1µF +/-20% 10V 0402)
C?#38  value 1uF/10V  [CAPC0402(1005)60_L]  (hidden comment: Capacitor 100nF +/-20% 10V 0402)
C?#39  value 22µF  [CAPC0805(2012)145_L]  (hidden comment: Capacitor 22µF +/-40% 16V 0805)
D?#2  SS32-E3/57T  [FP-SS32-E3-57T-MFG]
DS?  TLMS1100-GS08  [VISH-TLMX1100_V]
J?  35RASMT4BHNTRX  [SWIT-35RASMT4BHNTRX_V]
L?#9  Inductance: 3.3µH/2A  [CODA-CSAB0630-100M_V]  (hidden comment: CSAB0630-100M)
LED?  QBLP595-IB  [QTB-QBLP595_V]
Q?#1  8050 SOT 23  [ONSC-SOT-23-3-318-08_V]
Q?#2  WNM3003  [FAIR-TO-251-3]
Q?#3  WNM3003  [FAIR-TO-251-3]
Q?#4  WNM3003  [FAIR-TO-251-3]
Q?#5  WPM3407  [ONSC-SOT-23-3-318-08_V]
Q?#6  8050 SOT 23  [ONSC-SOT-23-3-318-08_V]
R?#6  value 4K7/5%  [RESC1005X40X25ML10T10]  (hidden comment: Resistor 4K7 +/-5% 0402)
R?#7  value 4K7/5%  [RESC1005X40X25ML10T10]  (hidden comment: Resistor 4K7 +/-5% 0402)
R?#8  value 4K7/5%  [RESC1005X40X25ML10T10]  (hidden comment: Resistor 4K7 +/-5% 0402)
R?#9  value 100mR/1%  [RESC0402(1005)_L]  (hidden comment: Resistor 1M +/-5 % 0402 63 mW)
R?#10  value 100mR/1%  [RESC0402(1005)_L]  (hidden comment: Resistor 1M +/-5 % 0402 63 mW)
R?#11  value 4K7/1%  [RESC0402(1005)_L]  (hidden comment: Resistor 2K37 +/-1 % 0402 63 mW)
R?#12  value 4K7/1%  [RESC0402(1005)_L]  (hidden comment: Resistor 2K37 +/-1 % 0402 63 mW)
R?#13  value 220K/1%  [RESC0402(1005)_L]  (hidden comment: Resistor 2K37 +/-1 % 0402 63 mW)
R?#14  value 30K/1%  [RESC0402(1005)_L]  (hidden comment: Resistor 2K37 +/-1 % 0402 63 mW)
R?#15  value 1M  [RESC0402(1005)_L]  (hidden comment: Resistor 1M +/-1 % 0402 63 mW)
R?#16  value 27K/1%  [RESC0402(1005)_L]  (hidden comment: Resistor 2K37 +/-1 % 0402 63 mW)
R?#17  value 220K/1%  [RESC0402(1005)_L]  (hidden comment: Resistor 2K37 +/-1 % 0402 63 mW)
R?#18  value 1M  [RESC0402(1005)_L]  (hidden comment: Resistor 1M +/-1 % 0402 63 mW)
R?#19  value 4.99K/1%  [RESC0402(1005)_L]  (hidden comment: Resistor 2K37 +/-1 % 0402 63 mW)
R?#20  value 30K/1%  [RESC0402(1005)_L]  (hidden comment: Resistor 2K37 +/-1 % 0402 63 mW)
R?#21  value 1k  [RESC0402(1005)_L]  (hidden comment: Resistor 1K +/-5 % 0402 63 mW)
R?#22  value 1M  [RESC0402(1005)_L]  (hidden comment: Resistor 1M +/-5 % 0402 63 mW)
R?#23  value 10  [RESC0402(1005)_L]  (hidden comment: Resistor 10R  +/-1 % 0402 63 mW)
R?#24  value 22  [RESC0402(1005)_L]  (hidden comment: Resistor 22R  +/-5 % 0402 63 mW)
R?#25  value 100K/1%  [RESC0402(1005)_L]  (hidden comment: Resistor 1M +/-5 % 0402 63 mW)
R?#26  value 100K/5%  [RESC0402(1005)_L]  (hidden comment: Resistor 2K37 +/-1 % 0402 63 mW)
U?  BQ24133RGYT  [RGY0024A_V]

### Ports
CHG_DET (out), DC_DET (out)

### Nets
3V3: C?#30.1 R?#13.1 R?#17.2 R?#19.2 R?#24.1 U?.12(VREF)
ACN: C?#27.1 C?#28.2 C?#39.1 D?#2.1(C) Q?#5.2(SOURCE) R?#9.2 U?.2(PVCC) U?.3(PVCC) U?.5(ACN)  [also labelled TP_005, VIN]
GND: C?#25.2 C?#26.2 C?#27.2 C?#30.2 C?#32.2 C?#33.2 C?#34.2 C?#36.1 C?#37.1 C?#38.1 C?#39.2 DS?.2(K) J?.1 J?.2 J?.4 Q?#1.2(E) Q?#6.2(E) R?#8.2 R?#14.2 R?#15.2 R?#16.2 R?#20.2 R?#25.2 U?.22(PGND) U?.23(PGND)  [also labelled TP_003]  [project net DDR1_RST]
TP_001: C?#25.1 J?.3 J?.5 Q?#4.3(S) R?#22.1 R?#23.1  [also labelled VDC_IN]
TP_002: C?#35.1 Q?#2.2(D) Q?#3.2(D) Q?#4.2(D) R?#6.1 R?#7.1 R?#12.2 R?#18.1  [also labelled VDC]
TP_004: Q?#6.3(C) ; port CHG_DET
VBATT: C?#29.2 C?#33.1 C?#34.1 D?#2.2(A) Q?#5.3(DRAIN) R?#10.2 U?.15(SRN)
NTC: LED?.1(K) R?#19.1 R?#20.1 R?#26.1 U?.9(STAT) U?.10(TS)
NetC?#26_1: C?#26.1 C?#28.1 Q?#2.3(S) R?#9.1 U?.6(ACP)
NetC?#29_1: C?#29.1 C?#32.1 L?#9.2 R?#10.1 U?.16(SRP)
NetC?#31_1: C?#31.1 U?.21(BTST)
NetC?#31_2: C?#31.2 L?#9.1 U?.1(SW) U?.24(SW)
NetC?#35_2: C?#35.2 Q?#2.1(G) Q?#3.3(S) Q?#4.1(G) R?#11.2 R?#18.2
NetC?#36_2: C?#36.2 U?.11(TTC)
NetC?#37_2: C?#37.2 U?.20(REGN)
NetC?#38_2: C?#38.2 R?#23.2 U?.4(AVCC)
NetDS?_1: DS?.1(A) R?#7.2
NetLED?_2: LED?.2(A) R?#24.2
NetQ?#1_1: Q?#1.1(B) R?#6.2 R?#8.1
NetQ?#1_3: Q?#1.3(C) ; port DC_DET
NetQ?#3_1: Q?#3.1(G) R?#15.1
NetQ?#5_1: Q?#5.1(GATE) R?#21.2
NetQ?#6_1: Q?#6.1(B) R?#26.2
NetR?#11_1: R?#11.1 U?.8(ACDRV)
NetR?#12_1: R?#12.1 U?.7(CMSRC)
NetR?#13_2: R?#13.2 R?#14.1 U?.17(ACSET)
NetR?#16_1: R?#16.1 R?#17.1 U?.13(ISET)
NetR?#21_1: R?#21.1 U?.19(~{BATDRV})
NetR?#22_2: R?#22.2 R?#25.1 U?.18(OVPSET)

Not connected (* = marked no-connect by the designer): U? 14(CELL)* 25(EP)

### Library data of the parts
C?#25 C?#32-C?#34 C?#36 C?#38 = CMP-001-00061-2: Chip Capacitor, 100nF +/-20%, 10V, 0402, Thickness 0.6 mm; Tolerance: 20%; Min Operating Temperature: -55°C; Case/Package: 0402; Pins: 2; Max Operating Temperature: 85°C; Voltage Rating: 10V; Mounting Technology: SMT
C?#26-C?#28 = CMP-001-00067-2: Chip Capacitor, 100nF +/-20%, 50V, 0402, Thickness 0.6 mm; Tolerance: 10%; Mounting Technology: SMT; Min Operating Temperature: -55°C; Pins: 2; Case/Package: 0402; Voltage Rating: 50V; Max Operating Temperature: 85°C
C?#29 = CMP-001-00065-2: Chip Capacitor, 100nF +/-20%, 25V, 0402, Thickness 0.6 mm; Tolerance: 10%; Pins: 2; Min Operating Temperature: -55°C; Max Operating Temperature: 85°C; Mounting Technology: SMT; Case/Package: 0603; Voltage Rating: 25V
C?#30 = CMP-001-00008-4: Chip Capacitor, 1 uF, +/- 10%, 6.3 V, 0402 (1005 Metric); Voltage Rating: 6.3V; Capacitor Type: Ceramic; Mounting Technology: SM; Min Operating Temperature: -55°C; Pins: 2; Case/Package: 0402; RoHS Compliant: True; Max Operating Temperature: 85°C; Tolerance: 10%
C?#31 C?#37 = CMP-001-00063-2: Chip Capacitor, 1µF +/-20%, 10V, 0402, Thickness 0.6 mm; Tolerance: 10%; Pins: 2; Max Operating Temperature: 85°C; Case/Package: 0402; Voltage Rating: 10V; Mounting Technology: SMT; Min Operating Temperature: -55°C
C?#35 = CMP-001-00054-2: Chip Capacitor, 100µF +/-20%, 6.3V, 0805, Thickness 1.45 mm; Tolerance: 10%; Case/Package: 0402; Min Operating Temperature: -55°C; Max Operating Temperature: 85°C; Pins: 2; Voltage Rating: 6.3V; Mounting Technology: SMT
C?#39 = CMP-001-00081-2: Chip Capacitor, 22µF +/-40%, 16V, 0805, Thickness 1.45 mm; Tolerance: 5%; Min Operating Temperature: -55°C; Mounting Technology: SMT; Case/Package: 0402; Pins: 2; Voltage Rating: 16V; Max Operating Temperature: 85°C
D?#2 = CMP-02539-000003-1: DIODE SCHOTTKY 20V 3A DO214AB; Manufacturer: Vishay; Peak Reverse Current: 0.5mA; Standoff Height: 0mm; Max Junction Temp: +150°C; Max Surge Forward Current: 100A; Mouser Description: Diode; Schottky Barrier; Vr 20V; If 3A; Pkg DO-214AB (SMC); Vf 0.5V; Tj +125degc; Cs 10; Dc Blocking Voltage: 20V; Height: 2.62mm; Forward Current: 3A; Footprint Url: http://www.vishay.com/docs/95402/smc.pdf; RoHS: TRUE; Lead Free: Yes; Max Repetitive Reverse Voltage: 20V; Reverse Voltage: 20V; Octopart: https://octopart.com/ss32-e3%2F57t-vishay-39552901; Package: DO-214AB; Digikey Description: DIODE SCHOTTKY 20V 3A DO214AB; Category: Diode; Device Class L3: Schottky Diodes; Automotive: No; Temperature Range High: +150°C; Device Class L2: Diodes; Temperature Range Low: -55°C; Device Class L1: Discrete Semiconductors; ComponentLink2Description: Datasheet; Temperature: -55°C to +150°C; ComponentLink2URL: http://www.vishay.com/docs/88751/ss32.pdf; Manufacturer Part Number: SS32-E3/57T
DS? = CMP-007-00030-1: Red Led, 20mA, 2.1 V, -40 to 100 degC, 2-Pin SMD (0603), RoHS, Tape and Reel; Manufacturer: Vishay Semiconductor; Forward Voltage: 2.1V; Lens Style: Clear; Luminous Intensity: 63mcd; Power: 90mW; Viewing Angle: 160degrees; Datasheet Version: Rev. 2.7, 03/2016; Package Reference: TLMX1100; Packaging: TapeandReel; Mounting Technology: SM; Illumination Colour: Red; Min Operating Temperature: -40°C; Case/Package: 0603; RoHS Compliant: True; Pins: 2; Max Operating Temperature: 100°C; Datasheet URL: http://www.vishay.com/docs/83173/tlmb1100.pdf; Package Description: 2-Pin Surface Mount Device, Body 1.6 x 0.8 mm; Manufacturer URL: http://www.vishay.com/; Nominal Vf: 2.1V; Colour: Red; Package Quantity: 3000; Forward Current: 20mA
J? = CMP-002-00007-1: Female 3.5 mm Phone Jack, 5 Position, Height 5 mm, RoHS, Tape and Reel; Manufacturer: Switchcraft; Current Rating: 3A; Voltage Rating: 250V; Shielding: Unshielded; Connector Type: Audio; Gender: Female; Manufacturer URL: http://www.switchcraft.com/; Package Reference: 35RASMT4BHNTRX; Case/Package: 35RASMT4BHNTRX; Contact Plating: Silver; Colour: Black; Min Operating Temperature: -25°C; Max Current Rating: 3A; Contact Material: Copper; Datasheet URL: http://www.switchcraft.com/Drawings/35rasmt4bhntrx_cd.pdf; Mounting Technology: SM; Datasheet Version: Rev. C, 07/2014; Package Description: Female 3.5 mm Phone Jack, 5 Position, Height 5 mm; Package Quantity: 800; Pins: 3; Packaging: TapeandReel; RoHS Compliant: True; Max Operating Temperature: 85°C
L?#9 = CMP-006-00001-2: Molded Inductor, 10 uH, +/- 20%, 77.2 mOhm, -55 to 125 degC, 2-Pin SMD, RoHS, Tape and Reel; Manufacturer: Shenzhen Codaca; Tolerance: 20%; Mounting Technology: SM; Datasheet URL: http://www.murata.com/products/catalog/pdf/c31e.pdf; Package Description: 2-Pin Surface Mount Device, Body 6 x 6 mm; Case/Package: CSAB0630-100M; RoHS Compliant: Unknown; Package Reference: CSAB0630-100M; Manufacturer URL: www.codaca.com.cn; Datasheet Version: Mar-14
LED? = CMP-007-00042-2: Chip LED 0402, Blue, 0.02 A, 3.1 to 3.7 V, -40 to 80 degC, 2-Pin SMD, RoHS, Tape and Reel; Mounting Technology: SMT; Colour: Blue; RoHS Compliant: Yes; Pins: 2; Case/Package: 0402
Q?#1 Q?#6 = CMP-1048-00662-1: High Voltage Transistor, NPN Silicon, 3-Pin SOT-23, Pb-Free, Tape and Reel; PartNumber: MMBTA42LT1G; Manufacturer: On Semiconductor; fT Min (MHz): 50; IC Continuous (A): 0.5; ComponentLink1URL: http://www.onsemi.com/; ComponentLink3URL: http://www.onsemi.cn/pub_link/Collateral/318-08.PDF; RoHS: TRUE; ComponentLink2Description: Datasheet; Polarity: NPN; DatasheetVersion: Rev. 12; PackageReference: SOT-23-3-318-08; PackageDescription: 3-Pin Small Outline Transistor, Body 2.92 x 1.3 mm, Pitch 0.95 mm; ComponentLink3Description: Package Specification; ComponentLink1Description: Manufacturer URL; Packing: Tape and Reel; PackageVersion: Rev. AP, 11/2009; Mounting Technology: Surface Mount; ComponentLink2URL: http://www.onsemi.cn/pub_link/Collateral/MMBTA42LT1-D.PDF
Q?#2-Q?#4 = CMP-013-00024-2: N-Channel QFET(R) MOSFET, 11 A, 60 V, 115 mOhm, -55 to 150 degC, 3-Pin TO-251, RoHS, Tube; Manufacturer: Fairchild; Input Capacitance: 350pF; Typical Rise Time: 90ns; Power: 2.5W; Elements: 1; Mounting Technology: TH; Pins: 3; RoHS Compliant: True; Packaging: Rail/Tube; Datasheet Version: Rev. 1.7, 07/2016; Package Quantity: 70; Datasheet URL: https://www.fairchildsemi.com/datasheets/FQ/FQU13N06L.pdf; Package Reference: TO-251-3; Case/Package: TO-251-3; Min Operating Temperature: -55°C; Max Operating Temperature: 150°C; Package Description: 3-Pin Flange Mount, Body 6.575 x 2.3 mm, Pitch 2.29 mm; Rds On Max: 115mohm
Q?#5 = CMP-013-00012-2: Power MOSFET Single P-Channel, -50 V, 10 Ohm, 3-Pin SOT-23, Pb-Free, Tape and Reel; Manufacturer: ON Semiconductor; Input Capacitance: 30pF; Nominal Vgs: -10V; Nominal Dual Supply Voltage: 5V; Power: 225mW; Elements: 1; Rds On Max: 10Ohm; Typical Rise Time: 1ns; Case/Package: SOT-23-3; Mounting Technology: SM; Max Operating Temperature: 150°C; Packaging: TapeandReel; Pins: 3; Datasheet Version: Rev. 9, 10/2016; Package Description: 3-Pin Small Outline Transistor, Body 2.9 x 1.3 mm, Pitch 0.95 mm; Datasheet URL: http://www.onsemi.com/pub_link/Collateral/BSS84LT1-D.PDF; Package Quantity: 3000; RoHS Compliant: True; Package Reference: SOT-23 (318-08); Min Operating Temperature: -55°C
R?#6-R?#8 = CMP-009-00020-4: Chip Resistor, 4K7 Ohm, +/- 5%, 0.063 W, -55 to 155 degC, 0402 (1005 Metric); Power: 63mW; Min Operating Temperature: -55°C; Tolerance: 5%; Pins: 2; RoHS Compliant: True; Max Operating Temperature: 155°C; Case/Package: 0402; Mounting Technology: SM
R?#9 R?#10 R?#22 R?#25 = CMP-009-00151-2: Chip Resistor, 1 MOhms, +/-5 %, 63 mW, -55 to 155 degC, 0402; Power: 63mW; Tolerance: 5%; Min Operating Temperature: -55°C; Max Operating Temperature: 155°C; Pins: 2; Case/Package: 0402
R?#11-R?#14 R?#16 R?#17 R?#19 R?#20 R?#26 = CMP-009-00162-2: Chip Resistor, 2,37 kOhms, +/-1 %, 63 mW, -55 to 155 degC, 0402; Tolerance: 1%; Power: 63mW; Pins: 2; Min Operating Temperature: -55°C; Case/Package: 0402; Max Operating Temperature: 155°C
R?#15 R?#18 = CMP-009-00165-2: Chip Resistor, 1 MOhms, +/-1 %, 63 mW, -55 to 155 degC, 0402; Tolerance: 1%; Power: 63mW; Case/Package: 0402; Pins: 2
R?#21 = CMP-009-00157-2: Chip Resistor, 1 kOhms, +/-5 %, 63 mW, -55 to 155 degC, 0402; Power: 63mW; Tolerance: 5%; Min Operating Temperature: -55°C; Max Operating Temperature: 155°C; Pins: 2; Case/Package: 0402
R?#23 = CMP-009-00152-2: Chip Resistor, 10 Ohms, +/-1 %, 63 mW, -55 to 155 degC, 0402; Power: 63mW; Tolerance: 1%; Min Operating Temperature: -55°C; Pins: 2; Max Operating Temperature: 155°C; Case/Package: 0402
R?#24 = CMP-009-00164-2: Chip Resistor, 22 Ohms, +/-5 %, 63 mW, -55 to 155 degC, 0402; Tolerance: 5%; Power: 63mW; Max Operating Temperature: 155°C; Case/Package: 0402; Pins: 2; Min Operating Temperature: -55°C
U? = CMP-0321-00108-2: Synchronous Switch-Mode Li-Ion and Li-Polymer Stand-Alone Battery Charger, -40 to 85 degC, 24-pin VQFN (RGY), Green (RoHS & no Sb/Br); Manufacturer: Texas Instruments; Li-Polymer: N; SubFamily: Battery Charge Management; ComponentLink1URL: http://www.ti.com/general/docs/lit/getliterature.tsp?genericPartNumber=BQ24133&fileType=pdf; Over Voltage Protection: N; Code_JEDEC: MO-241-BA; Li-Ion: N; ComponentLink1Description: Datasheet; NiCd: N; NiMH: N; Lead Acid: N; PackageDescription: 24-Leads Plastic Quad Flatpack No-Lead, 5.5 x 3.5 x 0.9 mm Body, 0.5 mm Pitch, Exposed Pad; PackageVersion: revI, Jun-2011; Mounting Technology: Surface Mount; PartNumber: BQ24133RGYT; Eco-Plan: Green (RoHS & no Sb/Br); DatasheetVersion: SLUSAF7B; PackageReference: RGY0024A